# Altium project USB-C_PD_power_supply.PrjPcb
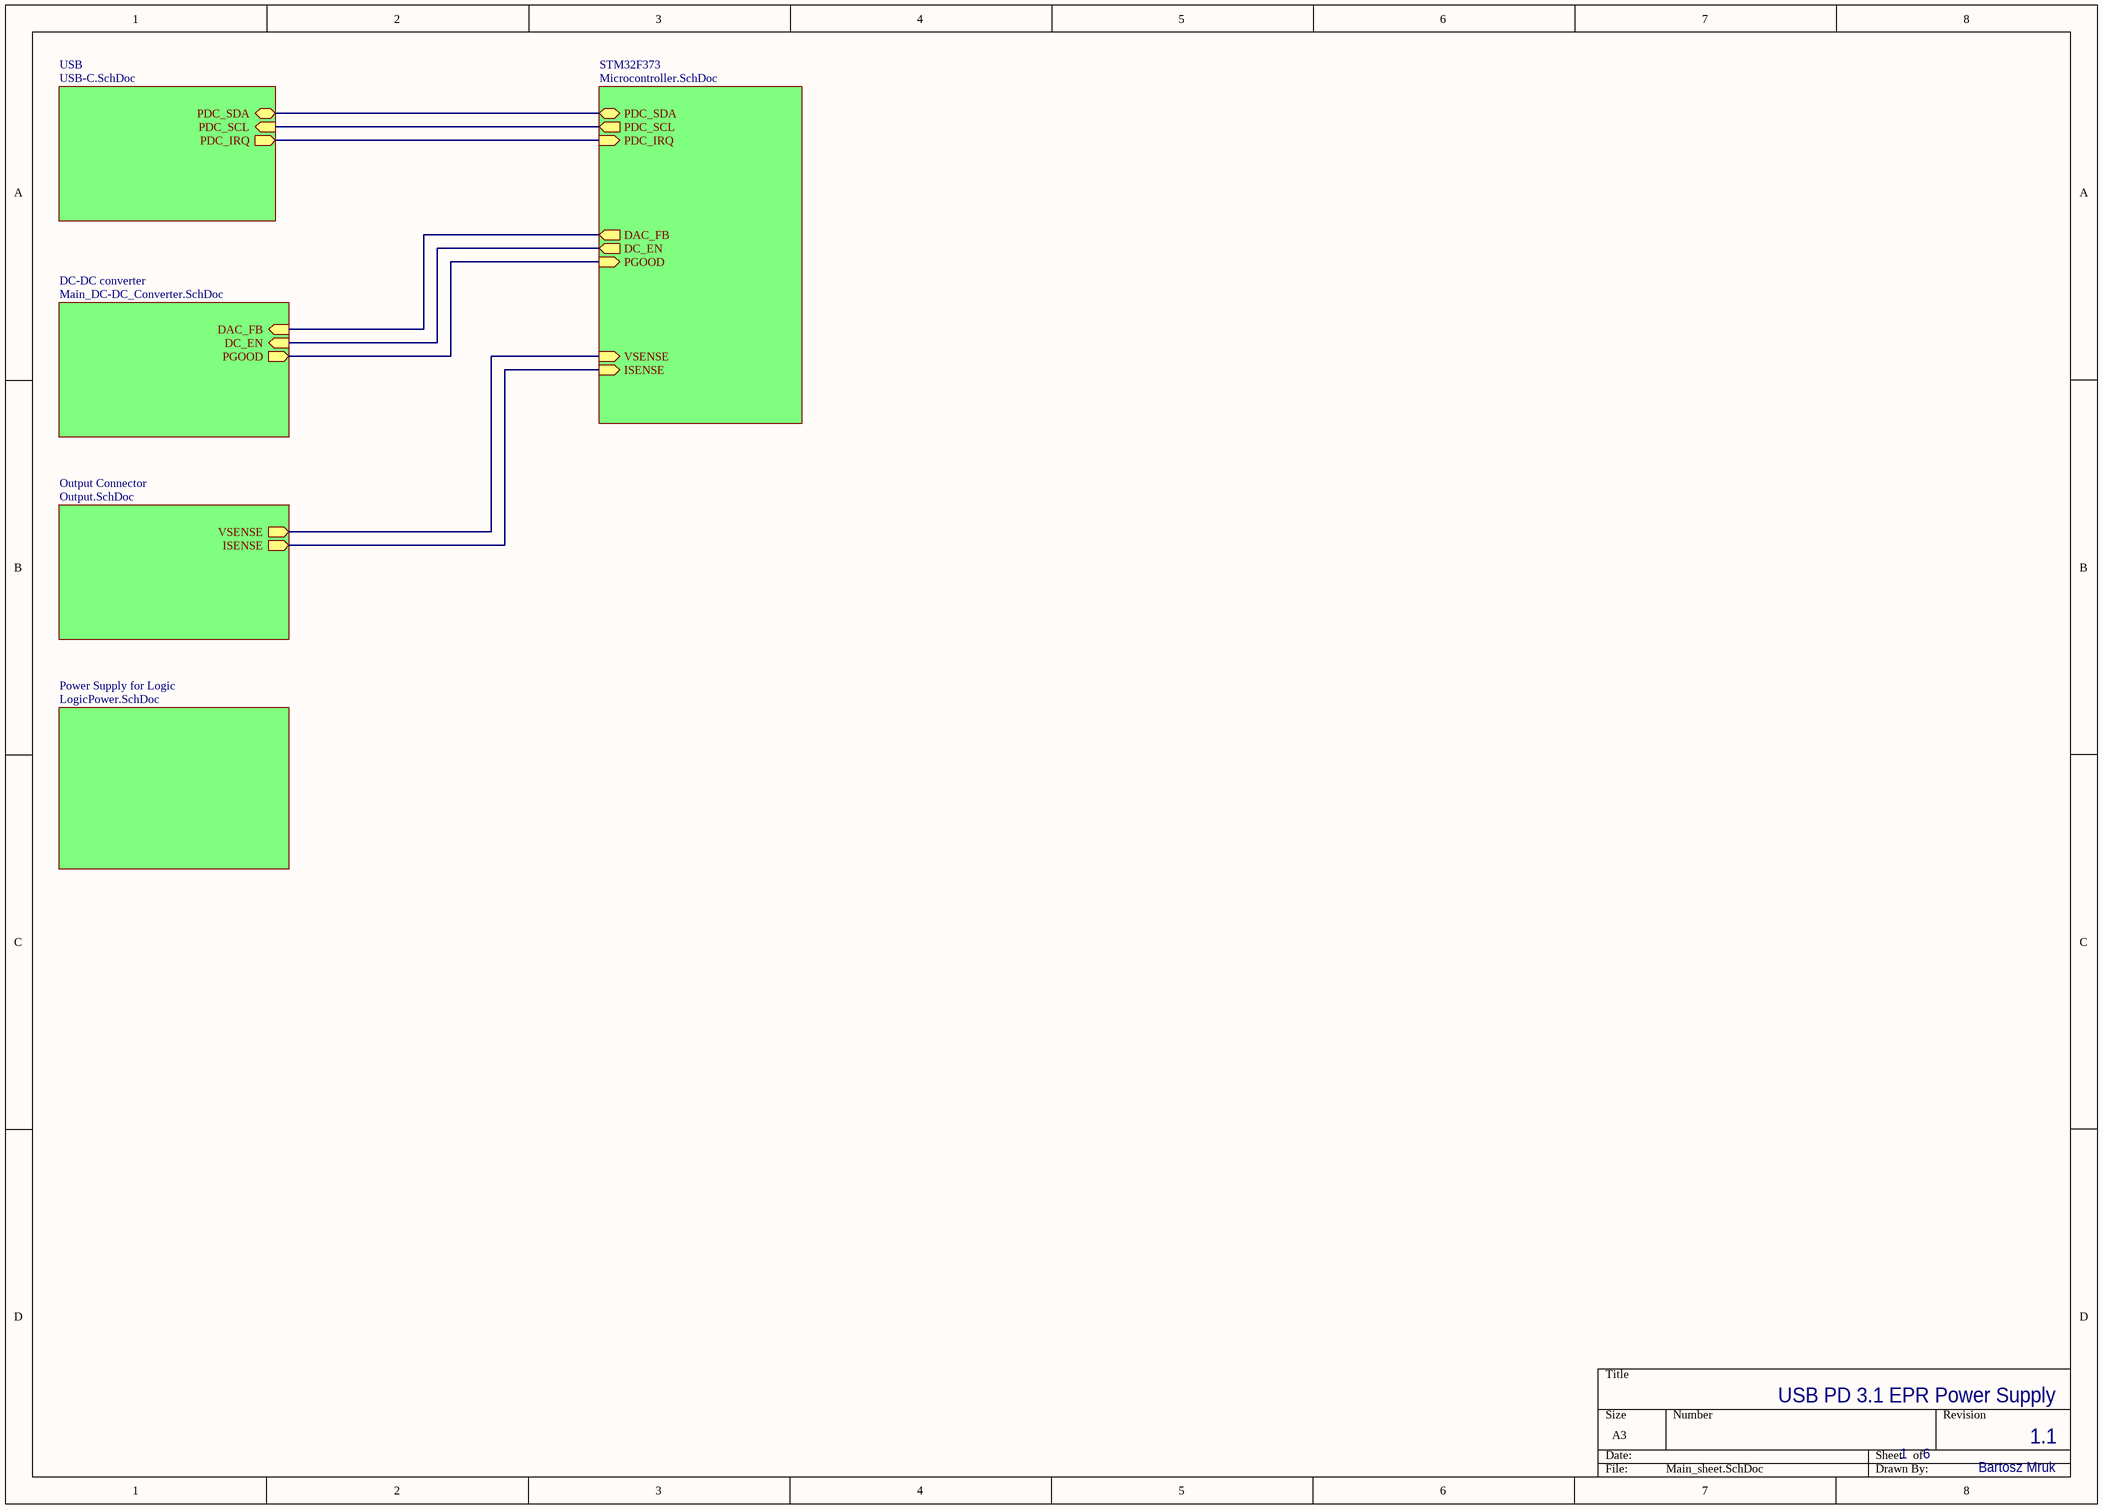
[diagram p0: Main_sheet.SchDoc]
6 sheets, 189 parts. Net scope: hierarchical (ports join the sheet entries above them; power ports are global).
Board file: Device.PcbDoc
Sheets:
  Main_sheet.SchDoc
    USB = USB-C.SchDoc
    STM32F373 = Microcontroller.SchDoc
    Power Supply for Logic = LogicPower.SchDoc
    DC-DC converter = Main_DC-DC_Converter.SchDoc
    Output Connector = Output.SchDoc

## Sheet Main_sheet.SchDoc
size A3; SheetNumber: 1; SheetTotal: 6

### Sub-sheets
DC-DC converter = Main_DC-DC_Converter.SchDoc: DAC_FB (in), DC_EN (in), PGOOD (out)
Output Connector = Output.SchDoc: VSENSE (out), ISENSE (out)
Power Supply for Logic = LogicPower.SchDoc: no entries
STM32F373 = Microcontroller.SchDoc: PDC_SDA (bidir), PDC_SCL (out), VSENSE (in), ISENSE (in), DAC_FB (out), PDC_IRQ (in), DC_EN (out), PGOOD (in)
USB = USB-C.SchDoc: PDC_SDA (bidir), PDC_SCL (in), PDC_IRQ (out)

### Nets
NetR1_2: sheet STM32F373/DC_EN, sheet DC-DC converter/DC_EN
NetR3_2: sheet STM32F373/PGOOD, sheet DC-DC converter/PGOOD
NetR4_1: sheet STM32F373/VSENSE, sheet Output Connector/VSENSE
NetR6_1: sheet STM32F373/ISENSE, sheet Output Connector/ISENSE
NetR10_2: sheet STM32F373/DAC_FB, sheet DC-DC converter/DAC_FB
NetR24_2: sheet USB/PDC_IRQ, sheet STM32F373/PDC_IRQ
NetR25_2: sheet USB/PDC_SDA, sheet STM32F373/PDC_SDA
NetR27_2: sheet USB/PDC_SCL, sheet STM32F373/PDC_SCL

### Notes on the sheet
- 1
- 6
- 1.1
- USB PD 3.1 EPR Power Supply
- Bartosz Mruk

## Sheet USB-C.SchDoc
size A3; SheetNumber: 3; SheetTotal: 6; SPICEModelCacheSZWREHAK: <root> / <DocumentId>SZWREHAK</DocumentId> / <CacheFrame Number="0"> / <Model Name="cap" Kind="MDL"> / <Text>*Default semiconductor capacitor / .MODEL CAP C()</Text> / </Model> / <Model Name="led2" Kind="MDL"> / <Text>*Typ RED,GREEN,YELLOW,AMBER GaAs LED: Vf=2.1V Vr=4V If=40mA trr=3uS / *LED Pinout: 1=A, 2=K / .MODEL LED2 D (IS=93.1P RS=42M N=4.61 BV=4 IBV=10U / + CJO=2.97P VJ=.75 M=.333 TT=4.32U)</Text> / </Model> / </CacheFrame> / </root>
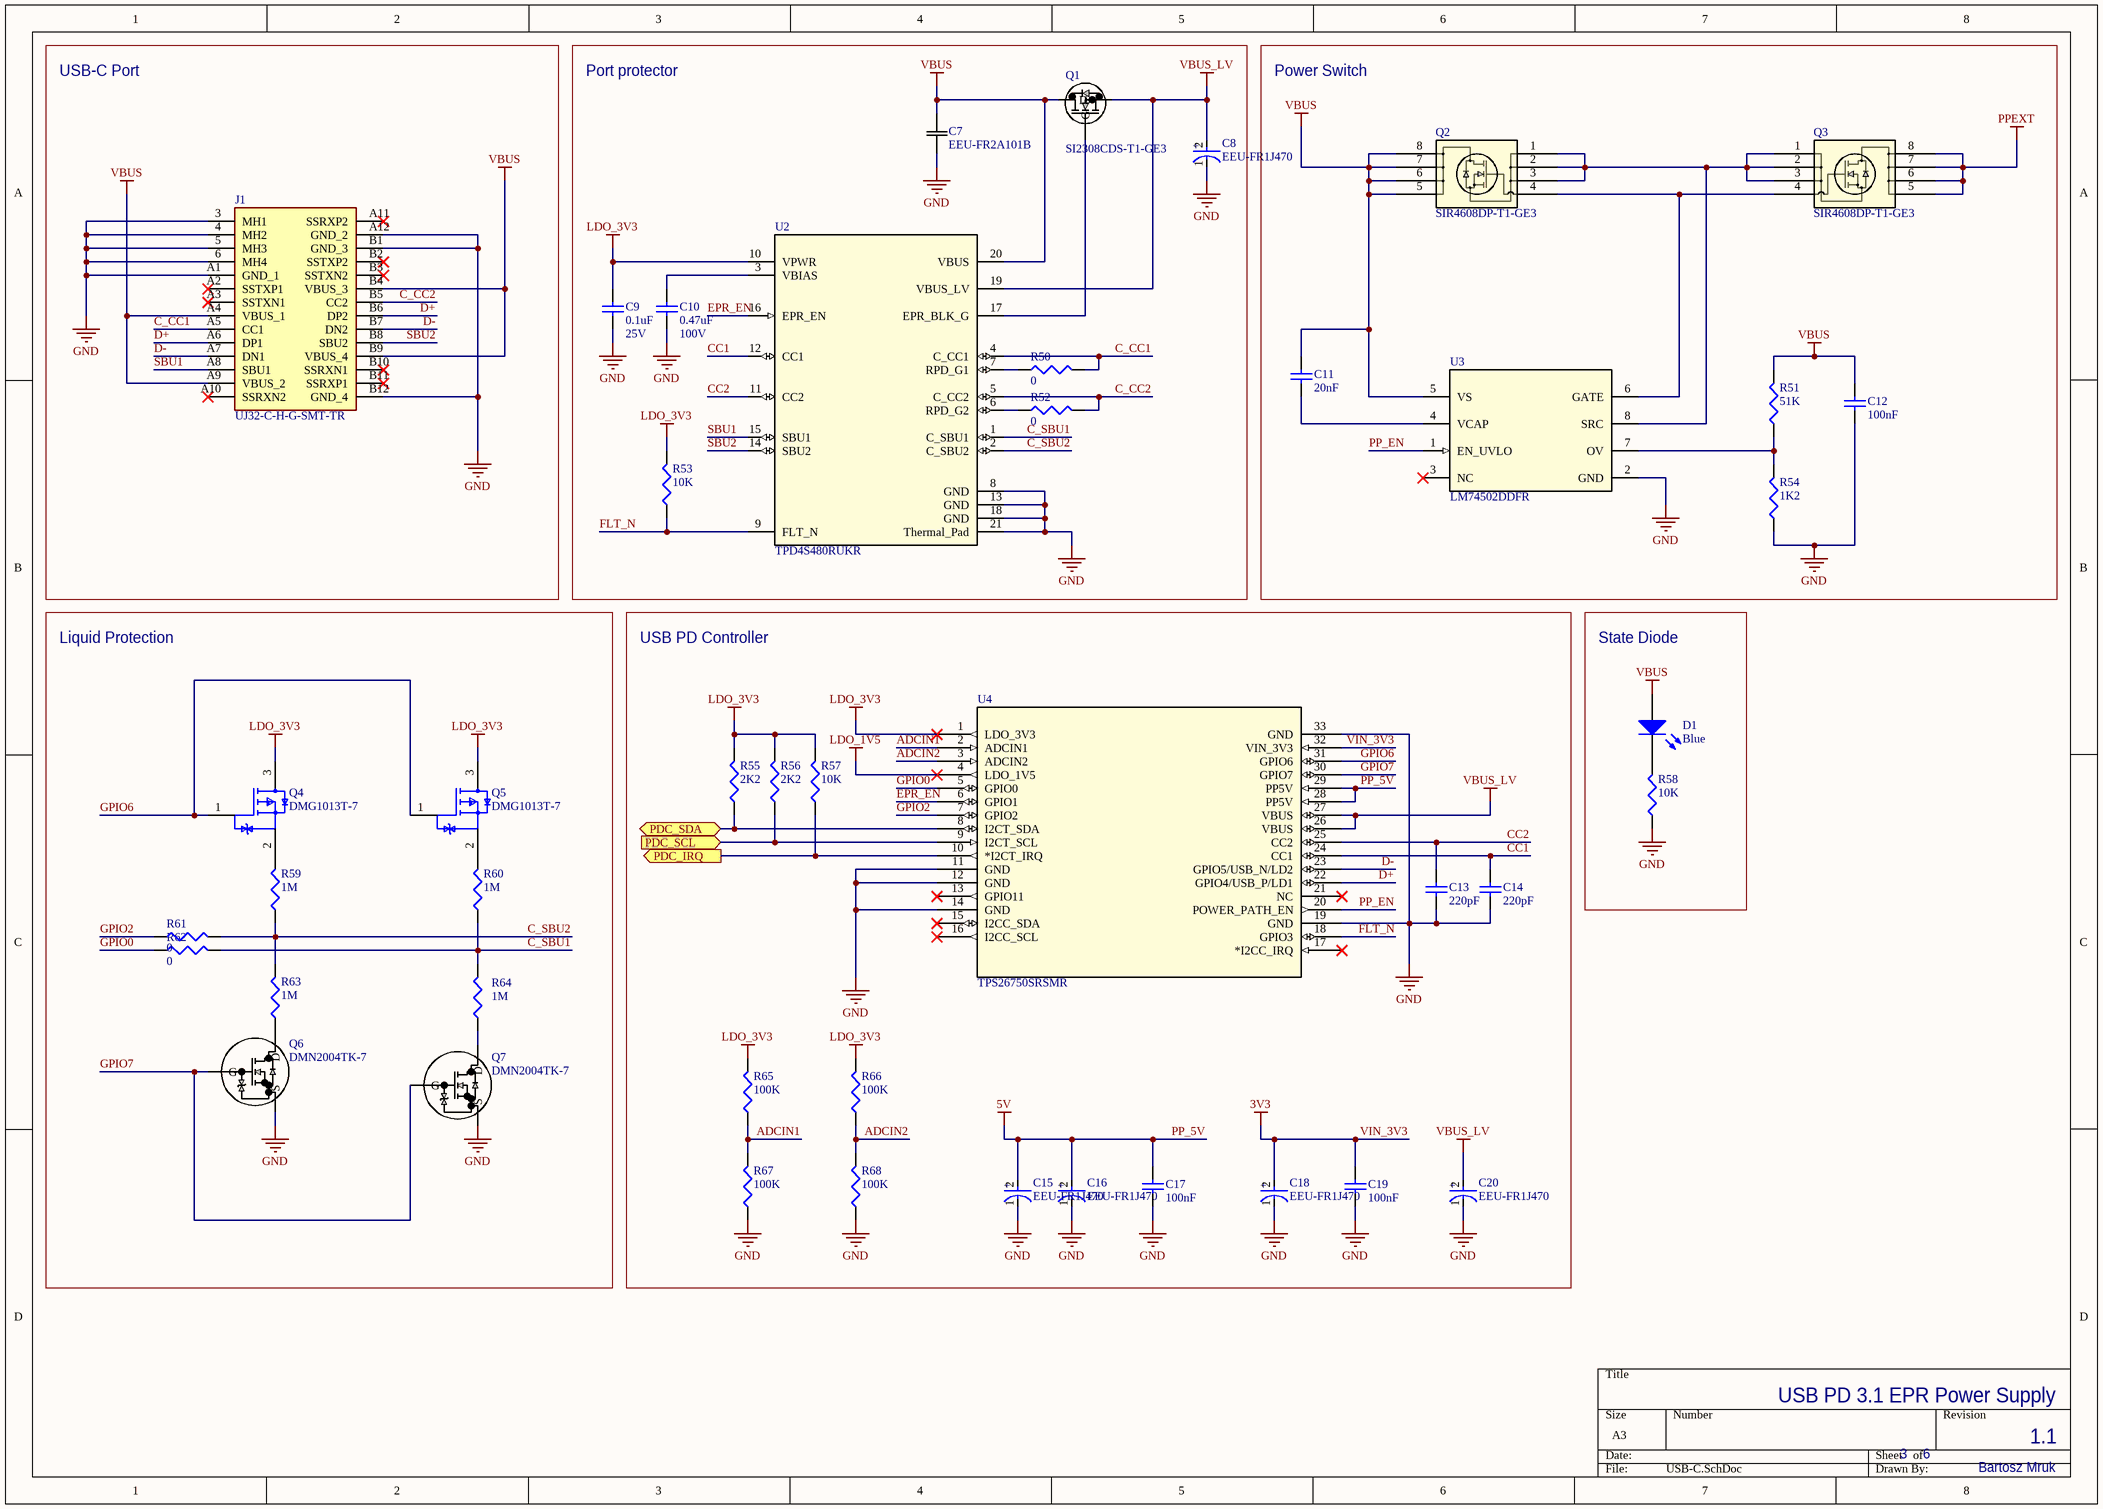
[diagram p1: USB-C.SchDoc]

### Parts
C7  EEU-FR2A101B  [CAP_EEU-FR2A101B_PAN]
C8  EEU-FR1J470  [FP-EEU-FR1J470-MFG]
C9  25V  value 0.1uF  [C1206]
C10  100V  value 0.47uF  [C1206]
C11  value 20nF  [C1206]  (hidden comment: at least 13V)
C12  value 100nF  [C1206]  (hidden comment: Cap Semi)
C13  value 220pF  [0402]  (hidden comment: Cap Semi)
C14  value 220pF  [0402]  (hidden comment: Cap Semi)
C15  EEU-FR1J470  [FP-EEU-FR1J470-MFG]
C16  EEU-FR1J470  [FP-EEU-FR1J470-MFG]
C17  value 100nF  [C1206]  (hidden comment: Cap Semi)
C18  EEU-FR1J470  [FP-EEU-FR1J470-MFG]
C19  value 100nF  [C1206]  (hidden comment: Cap Semi)
C20  EEU-FR1J470  [FP-EEU-FR1J470-MFG]
D1  Blue  [3.2X1.6X1.1]
J1  UJ32-C-H-G-SMT-TR  [UJ32CHGSMTTR]
Q1  SI2308CDS-T1-GE3  [SOT-23_TO-236_VIS]
Q2  SIR4608DP-T1-GE3  [POWERPAK_SO-8_SINGLE_VIS]
Q3  SIR4608DP-T1-GE3  [POWERPAK_SO-8_SINGLE_VIS]
Q4  DMG1013T-7  [FP-SOT523-IPC_A]
Q5  DMG1013T-7  [FP-SOT523-IPC_A]
Q6  DMN2004TK-7  [SOT523_DMN2004_DIO]
Q7  DMN2004TK-7  [SOT523_DMN2004_DIO]
R50  value 0  [J1-0603]  (hidden comment: Res3)
R51  value 51K  [J1-0603]  (hidden comment: Res3)
R52  value 0  [J1-0603]  (hidden comment: Res3)
R53  value 10K  [J1-0603]  (hidden comment: Res3)
R54  value 1K2  [J1-0603]  (hidden comment: Res3)
R55  value 2K2  [J1-0603]  (hidden comment: Res3)
R56  value 2K2  [J1-0603]  (hidden comment: Res3)
R57  value 10K  [J1-0603]  (hidden comment: Res3)
R58  value 10K  [J1-0603]  (hidden comment: Res3)
R59  value 1M  [J1-0603]  (hidden comment: Res3)
R60  value 1M  [J1-0603]  (hidden comment: Res3)
R61  value 0  [J1-0603]  (hidden comment: Res3)
R62  value 0  [J1-0603]  (hidden comment: Res3)
R63  value 1M  [J1-0603]  (hidden comment: Res3)
R64  value 1M  [J1-0603]  (hidden comment: Res3)
R65  value 100K  [J1-0603]  (hidden comment: Res3)
R66  value 100K  [J1-0603]  (hidden comment: Res3)
R67  value 100K  [J1-0603]  (hidden comment: Res3)
R68  value 100K  [J1-0603]  (hidden comment: Res3)
U2  TPD4S480RUKR  [RUK0020B-IPC_A]
U3  LM74502DDFR  [DDF0008A-IPC_A]
U4  TPS26750SRSMR  [VQFN32_RSM_TEX]

### Blocks framed on the sheet
USB-C Port: J1
Port protector: C7-C10 Q1 R50 R52 R53 U2
Power Switch: C11 C12 Q2 Q3 R51 R54 U3
Liquid Protection: Q4-Q7 R59-R64
USB PD Controller: C13-C20 R55-R57 R65-R68 U4
State Diode: D1 R58

### Ports
PDC_IRQ (out), PDC_SCL (in), PDC_SDA (bidir)

### Nets
3V3: C18.2(A) C19.2 U4.32(VIN_3V3)  [also labelled VIN_3V3]
5V: C15.2(A) C16.2(A) C17.2 U4.28(PP5V) U4.29(PP5V)  [also labelled PP_5V]
GND: C7.2 C8.1(C) C9.1 C10.1 C12.1 C13.1 C14.1 C15.1(C) C16.1(C) C17.1 C18.1(C) C19.1 C20.1(C) J1.3(MH1) J1.4(MH2) J1.5(MH3) J1.6(MH4) J1.A1(GND_1) J1.A12(GND_2) J1.B1(GND_3) J1.B12(GND_4) Q6.3(S) Q7.3(S) R54.1 R58.1 R67.1 R68.1 U2.8(GND) U2.13(GND) U2.18(GND) U2.21(Thermal_Pad) U3.2(GND) U4.11(GND) U4.12(GND) U4.14(GND) U4.19(GND) U4.33(GND)
LDO_1V5: U4.4(LDO_1V5)
LDO_3V3: C9.2 Q4.3(D) Q5.3(D) R53.2 R55.2 R56.2 R57.2 R65.2 R66.2 U2.10(VPWR) U4.1(LDO_3V3)
PPEXT: Q3.5 Q3.6 Q3.7 Q3.8
VBUS: C7.1 C11.2 C12.2 D1.1(A) J1.A4(VBUS_1) J1.A9(VBUS_2) J1.B4(VBUS_3) J1.B9(VBUS_4) Q1.2(D) Q2.5 Q2.6 Q2.7 Q2.8 R51.2 U2.20(VBUS) U3.5(VS)
VBUS_LV: C8.2(A) C20.2(A) Q1.3(S) U2.19(VBUS_LV) U4.26(VBUS) U4.27(VBUS)
ADCIN1: R65.1 R67.2 U4.2(ADCIN1)
ADCIN2: R66.1 R68.2 U4.3(ADCIN2)
C_CC1: J1.A5(CC1) R50.2 U2.4(C_CC1)
C_CC2: J1.B5(CC2) R52.2 U2.5(C_CC2)
C_SBU1: R60.1 R62.2 R64.2 U2.1(C_SBU1)
C_SBU2: R59.1 R61.2 R63.2 U2.2(C_SBU2)
CC1: C14.2 U2.12(CC1) U4.24(CC1)
CC2: C13.2 U2.11(CC2) U4.25(CC2)
D+: J1.A6(DP1) J1.B6(DP2) U4.22(GPIO4/USB_P/LD1)
D-: J1.A7(DN1) J1.B7(DN2) U4.23(GPIO5/USB_N/LD2)
EPR_EN: U2.16(EPR_EN) U4.6(GPIO1)
FLT_N: R53.1 U2.9(FLT_N) U4.18(GPIO3)
GPIO0: R62.1 U4.5(GPIO0)
GPIO2: R61.1 U4.7(GPIO2)
GPIO6: Q4.1(G) Q5.1(G) U4.31(GPIO6)
GPIO7: Q6.1(G) Q7.1(G) U4.30(GPIO7)
PP_EN: U3.1(EN_UVLO) U4.20(POWER_PATH_EN)
SBU1: J1.A8(SBU1) U2.15(SBU1)
SBU2: J1.B8(SBU2) U2.14(SBU2)
NetC10_2: C10.2 U2.3(VBIAS)
NetC11_1: C11.1 U3.4(VCAP)
NetD1_2: D1.2(K) R58.2
NetQ1_1: Q1.1(G) U2.17(EPR_BLK_G)
NetQ2_1: Q2.1 Q2.2 Q2.3 Q3.1 Q3.2 Q3.3 U3.8(SRC)
NetQ2_4: Q2.4 Q3.4 U3.6(GATE)
NetQ4_2: Q4.2(S) R59.2
NetQ5_2: Q5.2(S) R60.2
NetQ6_2: Q6.2(D) R63.1
NetQ7_2: Q7.2(D) R64.1
NetR24_2: R57.1 U4.10(*I2CT_IRQ) ; port PDC_IRQ
NetR25_2: R55.1 U4.8(I2CT_SDA) ; port PDC_SDA
NetR27_2: R56.1 U4.9(I2CT_SCL) ; port PDC_SCL
NetR50_1: R50.1 U2.7(RPD_G1)
NetR51_1: R51.1 R54.2 U3.7(OV)
NetR52_1: R52.1 U2.6(RPD_G2)

Not connected (* = marked no-connect by the designer): J1 A2(SSTXP1)* A3(SSTXN1)* A10(SSRXN2)* A11(SSRXP2)* B2(SSTXP2)* B3(SSTXN2)* B10(SSRXN1)* B11(SSRXP1)*; U3 3(NC)*; U4 13(GPIO11)* 15(I2CC_SDA)* 16(I2CC_SCL)* 17(*I2CC_IRQ)* 21(NC)*

### Notes on the sheet
- 3
- 6
- 1.1
- USB PD 3.1 EPR Power Supply
- Bartosz Mruk
- (in symbol CMP-05427-000066-1) +

### Library data of the parts
C7 = EEU-FR2A101B: No Description Available; Manufacturer_Name: Panasonic; Copyright: Copyright (C) 2025 Ultra Librarian. All rights reserved.; Manufacturer_Part_Number: EEU-FR2A101B
C8 C15 C16 C18 C20 = CMP-05427-000066-1: CAP ALUM 47UF 20% 63V RADIAL; ESR (Equivalent Series Resistance): 210mR; Lead Diameter: 0.5mm; Life (Hours): 5000Hour; Ripple Current (AC): 284mA; Height - Seated (Max): 0.5inch; Radiation Hardening: No; Termination: Radial; Contact Plating: Tin; Length: 11.2mm; Tolerance: 20%; Voltage: 63V; Max Operating Temperature: 105°C; Construction: Cylindrical; Lead Free: Lead Free; Series: FR; Mount: Through Hole; Lead Pitch: 2.5mm; Capacitance: 47uF; Case/Package: Radial; Voltage Rating (DC): 63V; Diameter: 6.3mm; Impedance: 210mR; RoHS Compliant: Yes; Height: 11.2mm; REACH SVHC: No SVHC; Package Quantity: 200; Ripple Current: 284mA; Voltage Rating: 63V; Packaging: Bulk; Min Operating Temperature: -40°C
C9-C14 C17 C19 = Cap Semi: Capacitor (Semiconductor SIM Model); Published: 8-Jun-2000; LatestRevisionDate: 29-May-2009; LatestRevisionNote: IPC-7351 Footprint Added.; PackageReference: C1206; Publisher: Altium Limited; PackageDescription: Chip Capacitor
D1 = LED2: Typical RED, GREEN, YELLOW, AMBER GaAs LED; Published: 8-Jun-2000; LatestRevisionDate: 17-Jul-2002; LatestRevisionNote: Re-released for DXP Platform.; PackageVersion: Feb-2002; PackageReference: 3.2X1.6X1.1; Publisher: Altium Limited; PackageDescription: SM LED; 2 Flat Leads
J1 = UJ32-C-H-G-SMT-TR: UJ32-C-H-G-SMT-TR - Type C, USB 3.2 Gen 2x2, 20 Gbps, 20 Vac, 5 A, Right Angle, Gold Flash, Surface Mount, Black Insulator, USB Receptacle; Manufacturer_Name: Same Sky; Geometry.Height: 3.71mm; Mouser Part Number: 179-UJ32CHGSMTTR; Mouser Price/Stock: https://www.mouser.co.uk/ProductDetail/CUI-Devices/UJ32-C-H-G-SMT-TR?qs=vvQtp7zwQdNJg60%252BwYKIHw%3D%3D; Manufacturer_Part_Number: UJ32-C-H-G-SMT-TR; Datasheet Link: https://www.sameskydevices.com/product/resource/UJ32-C-H-G-SMT-TR.pdf
Q1 = SI2308CDS-T1-GE3: N-CHANNEL 60-V (D-S) MOSFET; Manufacturer_Name: Vishay; Copyright: Copyright (C) 2025 Ultra Librarian. All rights reserved.; Manufacturer_Part_Number: SI2308CDS-T1-GE3
Q2 Q3 = SIR4608DP-T1-GE3: N-CHANNEL 60-V (D-S) MOSFET; Manufacturer_Name: Vishay; Copyright: Copyright (C) 2025 Ultra Librarian. All rights reserved.; Manufacturer_Part_Number: SIR4608DP-T1-GE3; RefDes: RefDes; Type: Type
Q4 Q5 = CMP-12801-000011-2: MOSFET P-CH 20V 0.46A SOT-523; Threshold Voltage: -1V; Continuous Drain Current (ID): 460mA; Rise Time: 8.1ns; Turn-Off Delay Time: 28.4ns; Number of Channels: 1; On-State Resistance: 700mR; Power Dissipation: 270mW; Input Capacitance: 59.76pF; Fall Time: 20.7ns; Turn-On Delay Time: 5.1ns; Drain to Source Resistance: 1R; Drain to Source Breakdown Voltage: -20V; Gate to Source Voltage (Vgs): 6V; Element Configuration: Single; Min Operating Temperature: -55°C; Max Operating Temperature: 150°C; Case/Package: SOT-523; Lead Free: Lead Free; Length: 1.7mm; REACH SVHC: No SVHC; Radiation Hardening: No; Number of Pins: 3; Weight: 7.1E-05oz; Rds On Max: 700mR; Height: 0.8mm; Number of Elements: 1; Packaging: Tape and Reel; Mount: Surface Mount; Width: 0.85mm; Drain to Source Voltage (Vdss): 20V; Max Power Dissipation: 270mW; Contact Plating: Tin; Package Quantity: 1
Q6 Q7 = DMN2004TK-7: Description; Manufacturer_Name: Diodes Inc; Copyright: Copyright (C) 2025 Ultra Librarian. All rights reserved.; Manufacturer_Part_Number: DMN2004TK-7
R50-R68 = Res3: Resistor; Published: 8-Jun-2000; LatestRevisionDate: 29-May-2009; LatestRevisionNote: IPC-7351 Footprint Added.; PackageReference: J1-0603; Publisher: Altium Limited; PackageDescription: Chip Resistor
U2 = TPD4S480RUKR: USB Type-Câ„¢ 48V EPR port protector with short-to-VBUS overvoltage and IEC ESD protection 20-WQFN -40 to 125; Manufacturer_Name: Texas Instruments; TYPE: TYPE; RefDes: RefDes; Copyright: Copyright (C) 2025 Ultra Librarian. All rights reserved.; Manufacturer_Part_Number: TPD4S480RUKR
U3 = LM74502DDFR: 3.2-V to 65-V industrial RPP controller with load disconnect and OVP 8-SOT-23-THIN -40 to 125; Manufacturer_Name: Texas Instruments; TYPE: TYPE; RefDes: RefDes; Copyright: Copyright (C) 2025 Ultra Librarian. All rights reserved.; Manufacturer_Part_Number: LM74502DDFR
U4 = TPS26750SRSMR: USB Type-CÂ® and USB Power Delivery (PD) 3.1 controller with 240-W extended power range support  32-VQFN -40 to 125; Manufacturer_Name: Texas Instruments; Copyright: Copyright (C) 2025 Ultra Librarian. All rights reserved.; Manufacturer_Part_Number: TPS26750SRSMR; RefDes: RefDes; Type: Type

## Sheet Microcontroller.SchDoc
size A3; SheetNumber: 2; SheetTotal: 6; SPICEModelCacheJBUTDGHS: <root> / <DocumentId>JBUTDGHS</DocumentId> / <CacheFrame Number="0"> / <Model Name="cap" Kind="MDL"> / <Text>*Default semiconductor capacitor / .MODEL CAP C()</Text> / </Model> / </CacheFrame> / </root>
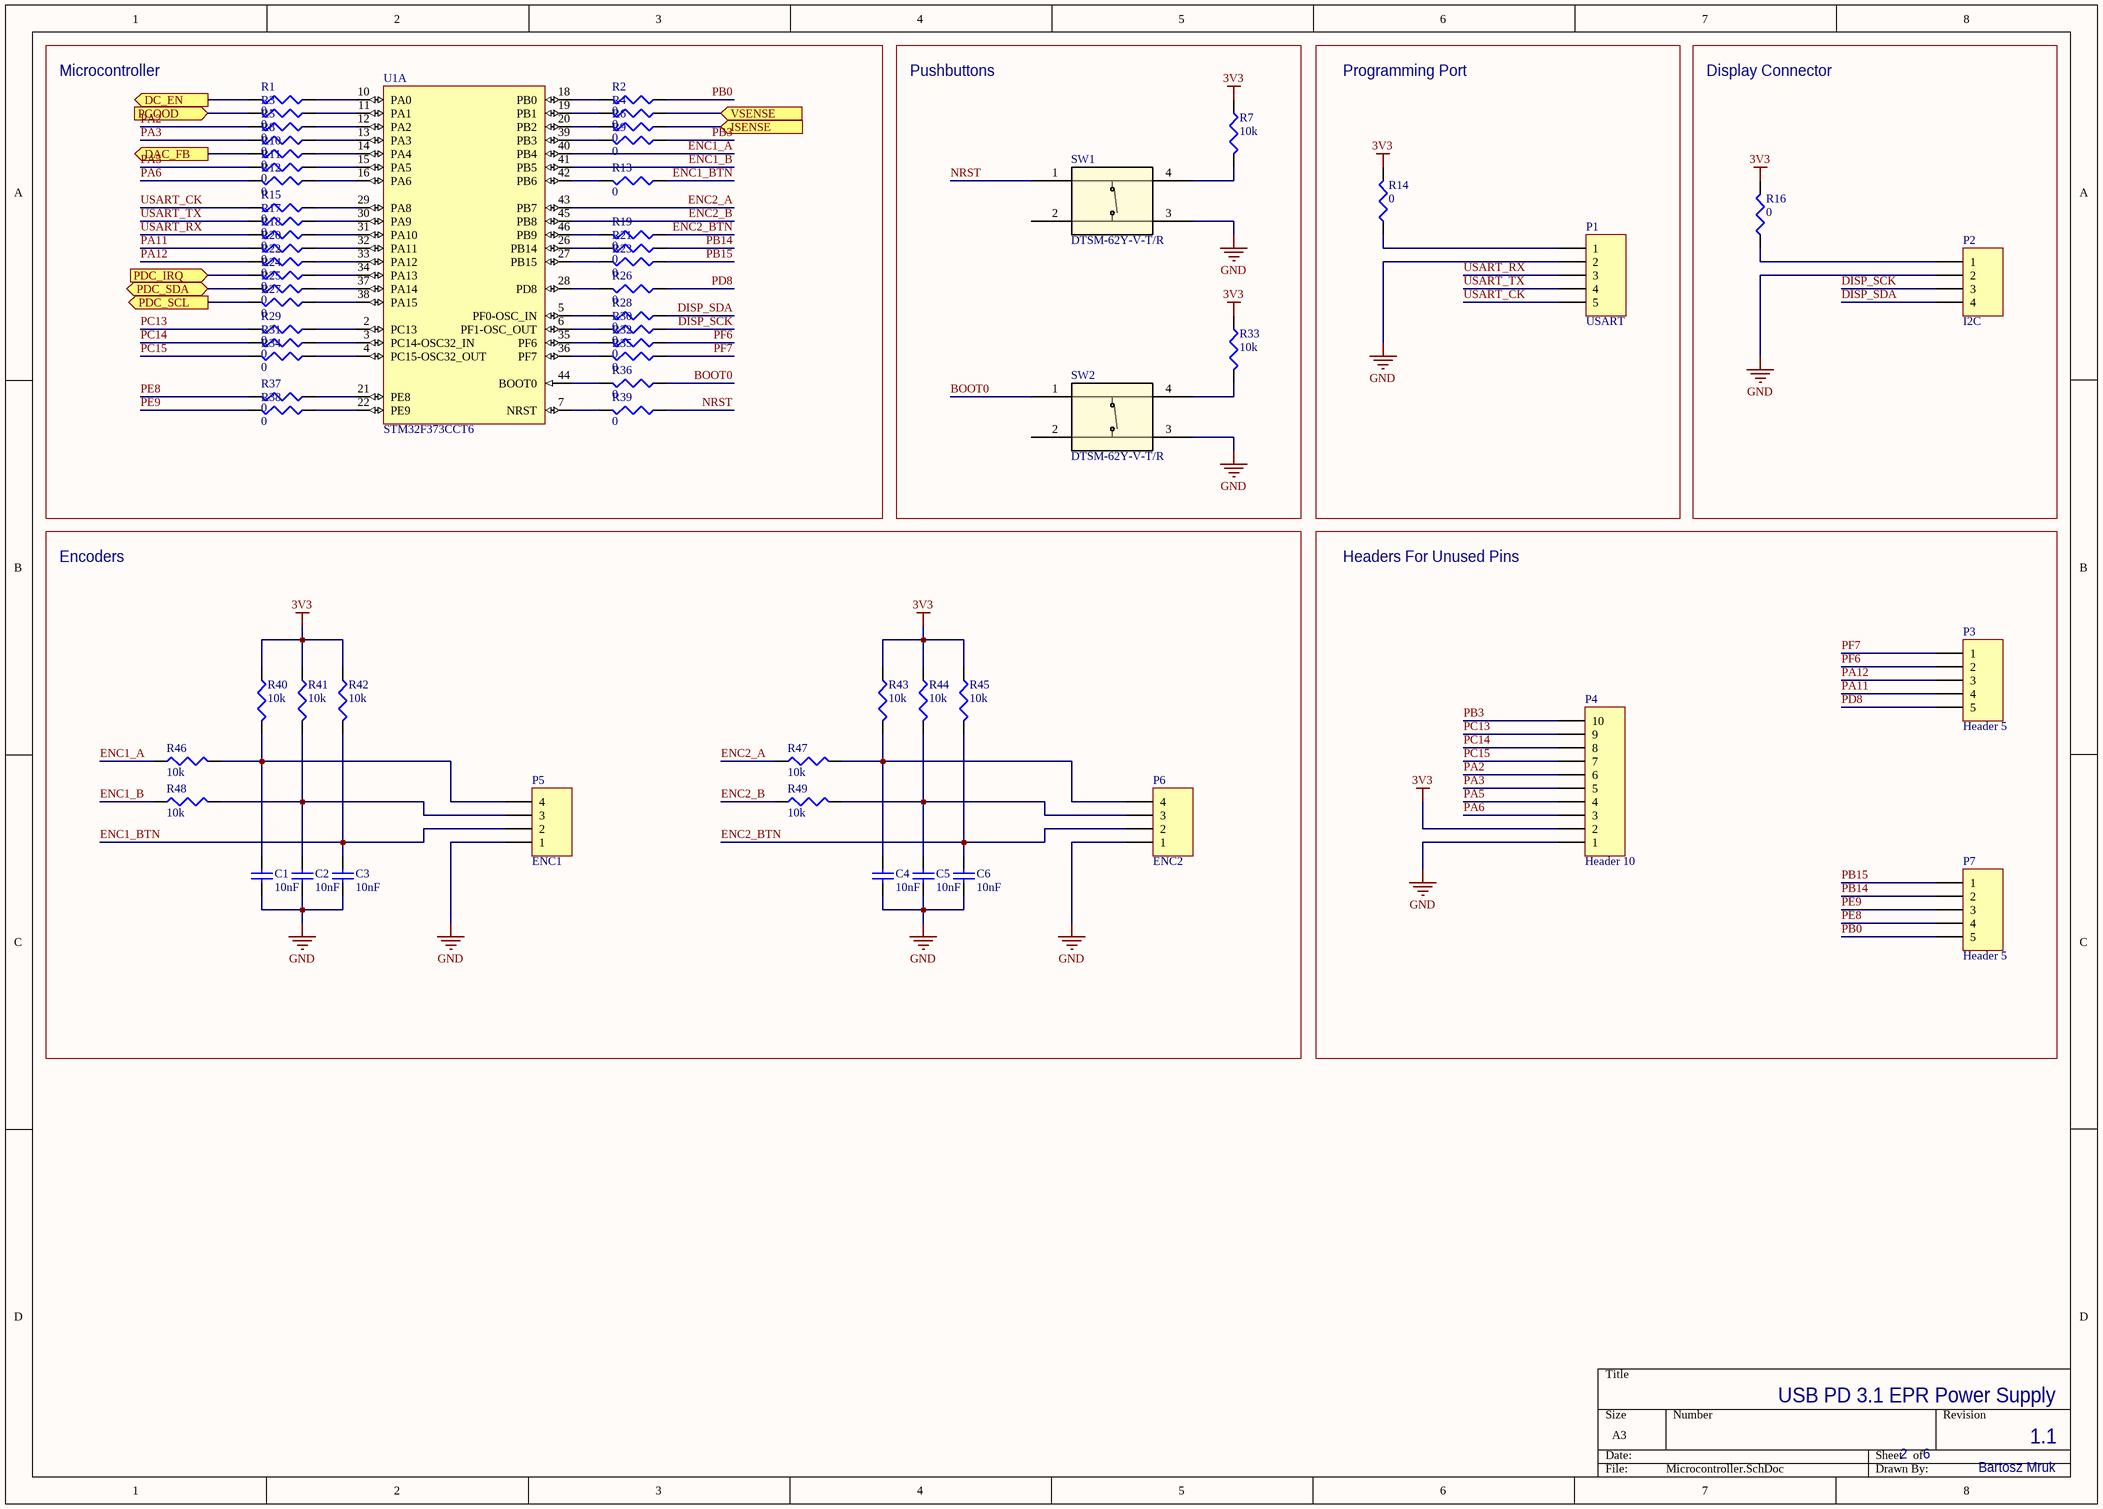
[diagram p2: Microcontroller.SchDoc]

### Parts
C1  value 10nF  [1608[0603]]  (hidden comment: Cap Semi)
C2  value 10nF  [1608[0603]]  (hidden comment: Cap Semi)
C3  value 10nF  [1608[0603]]  (hidden comment: Cap Semi)
C4  value 10nF  [1608[0603]]  (hidden comment: Cap Semi)
C5  value 10nF  [1608[0603]]  (hidden comment: Cap Semi)
C6  value 10nF  [1608[0603]]  (hidden comment: Cap Semi)
P1  USART  [HDR1X5]
P2  I2C  [HDR1X4]
P3  Header 5  [HDR1X5]
P4  Header 10  [HDR1X10]
P5  ENC1  [HDR1X4]
P6  ENC2  [HDR1X4]
P7  Header 5  [HDR1X5]
R1  value 0  [J1-0603]
R2  value 0  [J1-0603]
R3  value 0  [J1-0603]
R4  value 0  [J1-0603]
R5  value 0  [J1-0603]
R6  value 0  [J1-0603]
R7  value 10k  [J1-0603]
R8  value 0  [J1-0603]
R9  value 0  [J1-0603]
R10  value 0  [J1-0603]
R11  value 0  [J1-0603]
R12  value 0  [J1-0603]
R13  value 0  [J1-0603]
R14  value 0  [J1-0603]  (hidden comment: Res3)
R15  value 0  [J1-0603]
R16  value 0  [J1-0603]  (hidden comment: Res3)
R17  value 0  [J1-0603]
R18  value 0  [J1-0603]
R19  value 0  [J1-0603]
R20  value 0  [J1-0603]
R21  value 0  [J1-0603]
R22  value 0  [J1-0603]
R23  value 0  [J1-0603]
R24  value 0  [J1-0603]
R25  value 0  [J1-0603]
R26  value 0  [J1-0603]
R27  value 0  [J1-0603]
R28  value 0  [J1-0603]
R29  value 0  [J1-0603]
R30  value 0  [J1-0603]
R31  value 0  [J1-0603]
R32  value 0  [J1-0603]
R33  value 10k  [J1-0603]
R34  value 0  [J1-0603]
R35  value 0  [J1-0603]
R36  value 0  [J1-0603]
R37  value 0  [J1-0603]
R38  value 0  [J1-0603]
R39  value 0  [J1-0603]
R40  value 10k  [J1-0603]
R41  value 10k  [J1-0603]
R42  value 10k  [J1-0603]
R43  value 10k  [J1-0603]
R44  value 10k  [J1-0603]
R45  value 10k  [J1-0603]
R46  value 10k  [J1-0603]
R47  value 10k  [J1-0603]
R48  value 10k  [J1-0603]
R49  value 10k  [J1-0603]
SW1  DTSM-62Y-V-T/R  [DTSM-62_DIP]
SW2  DTSM-62Y-V-T/R  [DTSM-62_DIP]
U1  STM32F373CCT6  [STM-LQFP48_M]  (part A of 2)

### Blocks framed on the sheet
Microcontroller: R1-R6 R8-R13 R15 R17-R32 R34-R39 U1
Pushbuttons: R7 R33 SW1 SW2
Programming Port: P1 R14
Display Connector: P2 R16
Encoders: C1-C6 P5 P6 R40-R49
Headers For Unused Pins: P3 P4 P7

### Ports
DAC_FB (out), DC_EN (out), ISENSE (in), PDC_IRQ (in), PDC_SCL (out), PDC_SDA (bidir), PGOOD (in), VSENSE (in)

### Nets
3V3: P4.2 R7.1 R14.2 R16.2 R33.1 R40.1 R41.1 R42.1 R43.1 R44.1 R45.1
GND: C1.1 C2.1 C3.1 C4.1 C5.1 C6.1 P1.2 P2.2 P4.1 P5.1 P6.1 SW1.3 SW2.3
BOOT0: R36.1 SW2.1
DISP_SCK: P2.3 R30.1
DISP_SDA: P2.4 R28.1
ENC1_A: R46.1 U1.40(PB4)
ENC1_B: R48.1 U1.41(PB5)
ENC1_BTN: C3.2 P5.2 R13.1 R42.2
ENC2_A: R47.1 U1.43(PB7)
ENC2_B: R49.1 U1.45(PB8)
ENC2_BTN: C6.2 P6.2 R19.1 R45.2
NRST: R39.1 SW1.1
PA2: P4.6 R5.2
PA3: P4.5 R8.2
PA5: P4.4 R11.2
PA6: P4.3 R12.2
PA11: P3.4 R20.2
PA12: P3.3 R22.2
PB0: P7.5 R2.1
PB3: P4.10 R9.1
PB14: P7.2 R21.1
PB15: P7.1 R23.1
PC13: P4.9 R29.2
PC14: P4.8 R31.2
PC15: P4.7 R34.2
PD8: P3.5 R26.1
PE8: P7.4 R37.2
PE9: P7.3 R38.2
PF6: P3.2 R32.1
PF7: P3.1 R35.1
USART_CK: P1.5 R15.2
USART_RX: P1.3 R18.2
USART_TX: P1.4 R17.2
NetC1_2: C1.2 P5.4 R40.2 R46.2
NetC2_2: C2.2 P5.3 R41.2 R48.2
NetC4_2: C4.2 P6.4 R43.2 R47.2
NetC5_2: C5.2 P6.3 R44.2 R49.2
NetP1_1: P1.1 R14.1
NetP2_1: P2.1 R16.1
NetR1_1: R1.1 U1.10(PA0)
NetR1_2: R1.2 ; port DC_EN
NetR2_2: R2.2 U1.18(PB0)
NetR3_1: R3.1 U1.11(PA1)
NetR3_2: R3.2 ; port PGOOD
NetR4_1: R4.1 ; port VSENSE
NetR4_2: R4.2 U1.19(PB1)
NetR5_1: R5.1 U1.12(PA2)
NetR6_1: R6.1 ; port ISENSE
NetR6_2: R6.2 U1.20(PB2)
NetR7_2: R7.2 SW1.4
NetR8_1: R8.1 U1.13(PA3)
NetR9_2: R9.2 U1.39(PB3)
NetR10_1: R10.1 U1.14(PA4)
NetR10_2: R10.2 ; port DAC_FB
NetR11_1: R11.1 U1.15(PA5)
NetR12_1: R12.1 U1.16(PA6)
NetR13_2: R13.2 U1.42(PB6)
NetR15_1: R15.1 U1.29(PA8)
NetR17_1: R17.1 U1.30(PA9)
NetR18_1: R18.1 U1.31(PA10)
NetR19_2: R19.2 U1.46(PB9)
NetR20_1: R20.1 U1.32(PA11)
NetR21_2: R21.2 U1.26(PB14)
NetR22_1: R22.1 U1.33(PA12)
NetR23_2: R23.2 U1.27(PB15)
NetR24_1: R24.1 U1.34(PA13)
NetR24_2: R24.2 ; port PDC_IRQ
NetR25_1: R25.1 U1.37(PA14)
NetR25_2: R25.2 ; port PDC_SDA
NetR26_2: R26.2 U1.28(PD8)
NetR27_1: R27.1 U1.38(PA15)
NetR27_2: R27.2 ; port PDC_SCL
NetR28_2: R28.2 U1.5(PF0-OSC_IN)
NetR29_1: R29.1 U1.2(PC13)
NetR30_2: R30.2 U1.6(PF1-OSC_OUT)
NetR31_1: R31.1 U1.3(PC14-OSC32_IN)
NetR32_2: R32.2 U1.35(PF6)
NetR33_2: R33.2 SW2.4
NetR34_1: R34.1 U1.4(PC15-OSC32_OUT)
NetR35_2: R35.2 U1.36(PF7)
NetR36_2: R36.2 U1.44(BOOT0)
NetR37_1: R37.1 U1.21(PE8)
NetR38_1: R38.1 U1.22(PE9)
NetR39_2: R39.2 U1.7(NRST)

Not connected (* = marked no-connect by the designer): SW1 2; SW2 2

### Notes on the sheet
- 2
- 6
- 1.1
- USB PD 3.1 EPR Power Supply
- Bartosz Mruk

### Library data of the parts
C1-C6 = Cap Semi: Capacitor (Semiconductor SIM Model); Published: 8-Jun-2000; LatestRevisionDate: 29-May-2009; LatestRevisionNote: IPC-7351 Footprint Added.; PackageReference: C1206; Publisher: Altium Limited; PackageDescription: Chip Capacitor
P1 P3 P7 = Header 5: Header, 5-Pin; LatestRevisionDate: 17-Jul-2002; LatestRevisionNote: Re-released for DXP Platform.; Publisher: Altium Limited
P2 P5 P6 = Header 4: Header, 4-Pin; LatestRevisionDate: 17-Jul-2002; LatestRevisionNote: Re-released for DXP Platform.; Publisher: Altium Limited
P4 = Header 10: Header, 10-Pin; LatestRevisionDate: 17-Jul-2002; LatestRevisionNote: Re-released for DXP Platform.; Publisher: Altium Limited
R1-R49 = Res3: Resistor; Published: 8-Jun-2000; LatestRevisionDate: 29-May-2009; LatestRevisionNote: IPC-7351 Footprint Added.; PackageReference: J1-0603; Publisher: Altium Limited; PackageDescription: Chip Resistor
SW1 SW2 = DTSM-62Y-V-TR: Description; Manufacturer_Name: Diptronics; Copyright: Copyright (C) 2025 Ultra Librarian. All rights reserved.; Manufacturer_Part_Number: DTSM-62Y-V-T/R; RefDes: RefDes; Type: Type
U1 = CMP-0572-00021-2: ARM Cortex-M4 32-bit MCU, 256 KB Flash, 32 KB Internal RAM, 36 I/Os, 48-pin LQFP, -40 to 85 degC, Tray; FLASH Size (Prog) (kB): 256; Internal RAM Size (kB): 32; Operating Frequency(F) (Processor speed) (MHz): 72; I/Os (High Current): 36; Supply Voltage(Vcc) min (V): 2; Mounting Technology: Surface Mount; ComponentLink2Description: Datasheet; PackageReference: LQFP48; Packing: Tray; PackageVersion: Rev. 6, 06/2013; ComponentLink1Description: Manufacturer URL; ComponentLink3Description: Package Specification; ComponentLink2URL: http://www.st.com/st-web-ui/static/active/en/resource/technical/document/datasheet/DM00046749.pdf; PartNumber: STM32F373CCT6; Core: ARM Cortex-M4; ComponentLink1URL: http://www.st.com/web/en/home.html; ComponentLink3URL: http://www.st.com/st-web-ui/static/active/en/resource/technical/document/datasheet/DM00058181.pdf; DatasheetVersion: Rev. 3; PackageDescription: 48-Pin Low Profile Quad Flat Package, 7 x 7 mm Body, 0.5 mm Pitch

## Sheet LogicPower.SchDoc
size A3; SheetNumber: 4; SheetTotal: 6; SPICEModelCacheUIACBXDH: <root> / <DocumentId>UIACBXDH</DocumentId> / <CacheFrame Number="0"> / <Model Name="cap" Kind="MDL"> / <Text>*Default semiconductor capacitor / .MODEL CAP C()</Text> / </Model> / </CacheFrame> / </root>
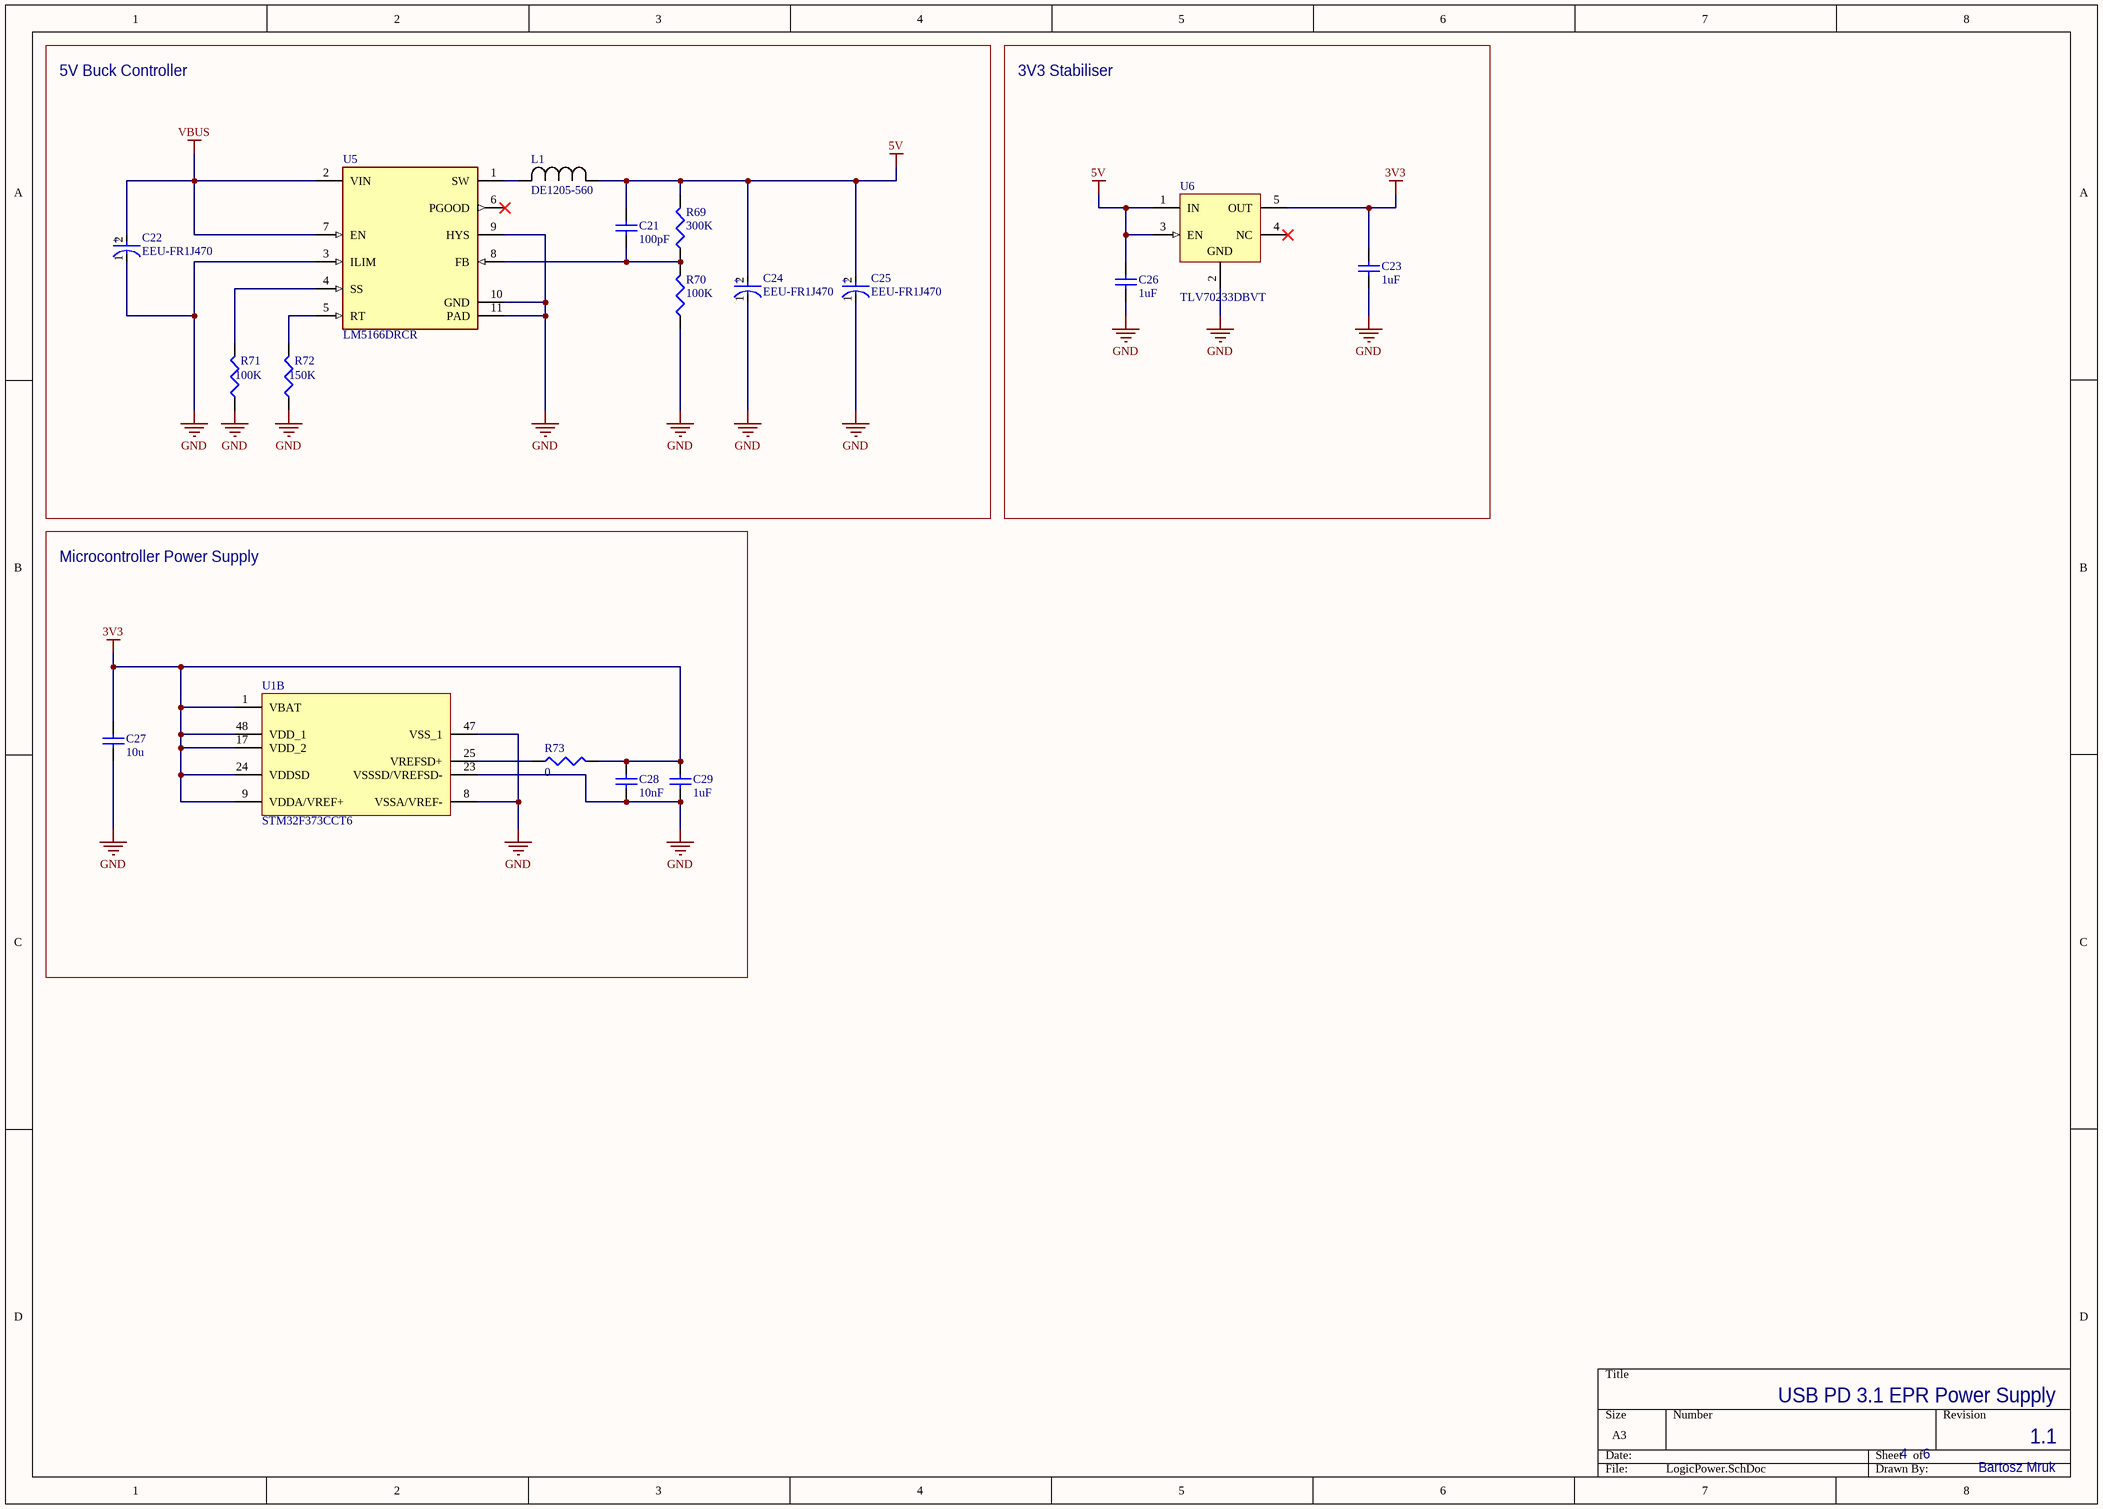
[diagram p3: LogicPower.SchDoc]

### Parts
C21  value 100pF  [C1206]  (hidden comment: Cap Semi)
C22  EEU-FR1J470  [FP-EEU-FR1J470-MFG]
C23  value 1uF  [C1206]  (hidden comment: Cap Semi)
C24  EEU-FR1J470  [FP-EEU-FR1J470-MFG]
C25  EEU-FR1J470  [FP-EEU-FR1J470-MFG]
C26  value 1uF  [C1206]  (hidden comment: Cap Semi)
C27  value 10u  [C1206]  (hidden comment: Cap Semi)
C28  value 10nF  [C1206]  (hidden comment: Cap Semi)
C29  value 1uF  [C1206]  (hidden comment: Cap Semi)
L1  DE1205-560  [IND_DE1205_FRC]
R69  value 300K  [J1-0603]  (hidden comment: Res3)
R70  value 100K  [J1-0603]  (hidden comment: Res3)
R71  value 100K  [J1-0603]  (hidden comment: Res3)
R72  value 150K  [J1-0603]  (hidden comment: Res3)
R73  value 0  [J1-0603]  (hidden comment: Res3)
U1  STM32F373CCT6  [STM-LQFP48_M]  (part B of 2)
U5  LM5166DRCR  [FP-DRC0010J-MFG]
U6  TLV70233DBVT  [DBV0005A_M]

### Blocks framed on the sheet
5V Buck Controller: C21 C22 C24 C25 L1 R69-R72 U5
3V3 Stabiliser: C23 C26 U6
Microcontroller Power Supply: C27-C29 R73 U1

### Nets
3V3: C23.2 C27.2 C28.2 C29.2 R73.2 U1.1(VBAT) U1.9(VDDA/VREF+) U1.17(VDD_2) U1.24(VDDSD) U1.48(VDD_1) U6.5(OUT)
5V: C21.2 C24.2(A) C25.2(A) C26.2 L1.1 R69.2 U6.1(IN) U6.3(EN)
GND: C22.1(C) C23.1 C24.1(C) C25.1(C) C26.1 C27.1 C28.1 C29.1 R70.1 R71.1 R72.1 U1.8(VSSA/VREF-) U1.23(VSSSD/VREFSD-) U1.47(VSS_1) U5.3(ILIM) U5.9(HYS) U5.10(GND) U5.11(PAD) U6.2(GND)
VBUS: C22.2(A) U5.2(VIN) U5.7(EN)
NetC21_1: C21.1 R69.1 R70.2 U5.8(FB)
NetL1_2: L1.2 U5.1(SW)
NetR71_2: R71.2 U5.4(SS)
NetR72_2: R72.2 U5.5(RT)
NetR73_1: R73.1 U1.25(VREFSD+)

Not connected (* = marked no-connect by the designer): U5 6(PGOOD)*; U6 4(NC)*

### Notes on the sheet
- 4
- 6
- 1.1
- USB PD 3.1 EPR Power Supply
- Bartosz Mruk
- (in symbol CMP-05427-000066-1) +

### Library data of the parts
C21 C23 C26-C29 = Cap Semi: Capacitor (Semiconductor SIM Model); Published: 8-Jun-2000; LatestRevisionDate: 29-May-2009; LatestRevisionNote: IPC-7351 Footprint Added.; PackageReference: C1206; Publisher: Altium Limited; PackageDescription: Chip Capacitor
C22 C24 C25 = CMP-05427-000066-1: as C8 on sheet USB-C; Height - Seated (Max): 0.5inch; Radiation Hardening: No; Termination: Radial; Contact Plating: Tin; Length: 11.2mm; Tolerance: 20%; Voltage: 63V; Max Operating Temperature: 105°C; Construction: Cylindrical; Lead Free: Lead Free; Series: FR; Mount: Through Hole; Lead Pitch: 2.5mm; Capacitance: 47uF; Case/Package: Radial; Voltage Rating (DC): 63V; Diameter: 6.3mm; Impedance: 210mR; RoHS Compliant: Yes; Height: 11.2mm; REACH SVHC: No SVHC; Package Quantity: 200; Ripple Current: 284mA; Voltage Rating: 63V; Packaging: Bulk; Min Operating Temperature: -40°C
L1 = DE1205-560: Description; Manufacturer_Name: FerroCore; Copyright: Copyright (C) 2025 Ultra Librarian. All rights reserved.; Manufacturer_Part_Number: DE1205-560
R69-R73 = Res3: Resistor; Published: 8-Jun-2000; LatestRevisionDate: 29-May-2009; LatestRevisionNote: IPC-7351 Footprint Added.; PackageReference: J1-0603; Publisher: Altium Limited; PackageDescription: Chip Resistor
U1 = CMP-0572-00021-2: as U1 on sheet Microcontroller; Mounting Technology: Surface Mount; ComponentLink2Description: Datasheet; PackageReference: LQFP48; Packing: Tray; PackageVersion: Rev. 6, 06/2013; ComponentLink1Description: Manufacturer URL; ComponentLink3Description: Package Specification; ComponentLink2URL: http://www.st.com/st-web-ui/static/active/en/resource/technical/document/datasheet/DM00046749.pdf; PartNumber: STM32F373CCT6; Core: ARM Cortex-M4; ComponentLink1URL: http://www.st.com/web/en/home.html; ComponentLink3URL: http://www.st.com/st-web-ui/static/active/en/resource/technical/document/datasheet/DM00058181.pdf; DatasheetVersion: Rev. 3; PackageDescription: 48-Pin Low Profile Quad Flat Package, 7 x 7 mm Body, 0.5 mm Pitch
U5 = CMP-04918-000087-1: IC REG BUCK ADJ 500MA 10VSON; Manufacturer: Texas Instruments; Output Voltage: 1.23-65V; Switching Frequency: 50-600kHz; Nominal Supply Current: 205-320uA; Max Supply Voltage: 65V; Min Supply Voltage: 3V; Output Type: AdjustableProgrammable; Max Duty Cycle: 100%; Max Junction Temp: +150°C; Standoff Height: 0mm; Number Of Outputs: 1; Temperature Range Low: -40°C; Octopart: https://octopart.com/lm5166drcr-texas+instruments-77040222; Height: 1mm; Temperature: -40°C to +150°C; ComponentLink2Description: Datasheet; Device Class L1: Integrated Circuits (ICs); ComponentLink2URL: http://www.ti.com/lit/ds/symlink/lm5166.pdf; Device Class L3: Voltage Regulators - Switching; Lead Free: Yes; Manufacturer Part Number: LM5166DRCR; RoHS: TRUE; Switching Topology: Buck; Package: DRC0010J; Digikey Description: IC REG BUCK ADJ 500MA 10VSON; Temperature Range High: +150°C; Output Current: 500mA; Category: IC; Automotive: No; Device Class L2: Power Management ICs
U6 = CMP-0394-00524-3: None; Max Output Voltage: 3.3V; Min Input Voltage: 2V; Quiescent Current: 30uA; Accuracy: 2%; Number of Outputs: 1; Power Dissipation: 500mW; Dropout Voltage: 220mV; Output Voltage Accuracy: 0.5%; Max Output Current: 300mA; Polarity: Positive; Power Supply Rejection Ratio (PSRR): 68dB; Output Type: Fixed; Max Input Voltage: 5.5V; Min Current Limit: 320mA; REACH SVHC: No SVHC; RoHS Compliant: Yes; Length: 3.05mm; Radiation Hardening: No; Lead Free: Lead Free; Height: 1.45mm; Output Voltage: 3.3V; Min Operating Temperature: -40°C; Package Quantity: 1; Width: 1.75mm; Number of Regulators: 1; Case/Package: SOT-23; Number of Pins: 5; Output Current: 300mA; Packaging: Tape and Reel; Min Output Voltage: 3.3V; Max Operating Temperature: 125°C; Series: -; Nominal Output Voltage: 3.3V; Max Power Dissipation: 500mW

## Sheet Main_DC-DC_Converter.SchDoc
size A3; SheetNumber: 5; SheetTotal: 6; SPICEModelCacheKWJYRVGK: <root> / <DocumentId>KWJYRVGK</DocumentId> / <CacheFrame Number="0"> / <Model Name="cap" Kind="MDL"> / <Text>*Default semiconductor capacitor / .MODEL CAP C()</Text> / </Model> / <Model Name="skydiode" Kind="MDL"> / <Text>*Default Schottky Diode / *Schottky Diode Pinout: A,K / .MODEL SKYDIODE D(EG=0.69 XTI=2)</Text> / </Model> / <Model Name="led2" Kind="MDL"> / <Text>*Typ RED,GREEN,YELLOW,AMBER GaAs LED: Vf=2.1V Vr=4V If=40mA trr=3uS / *LED Pinout: 1=A, 2=K / .MODEL LED2 D (IS=93.1P RS=42M N=4.61 BV=4 IBV=10U / + CJO=2.97P VJ=.75 M=.333 TT=4.32U)</Text> / </Model> / </CacheFrame> / </root>
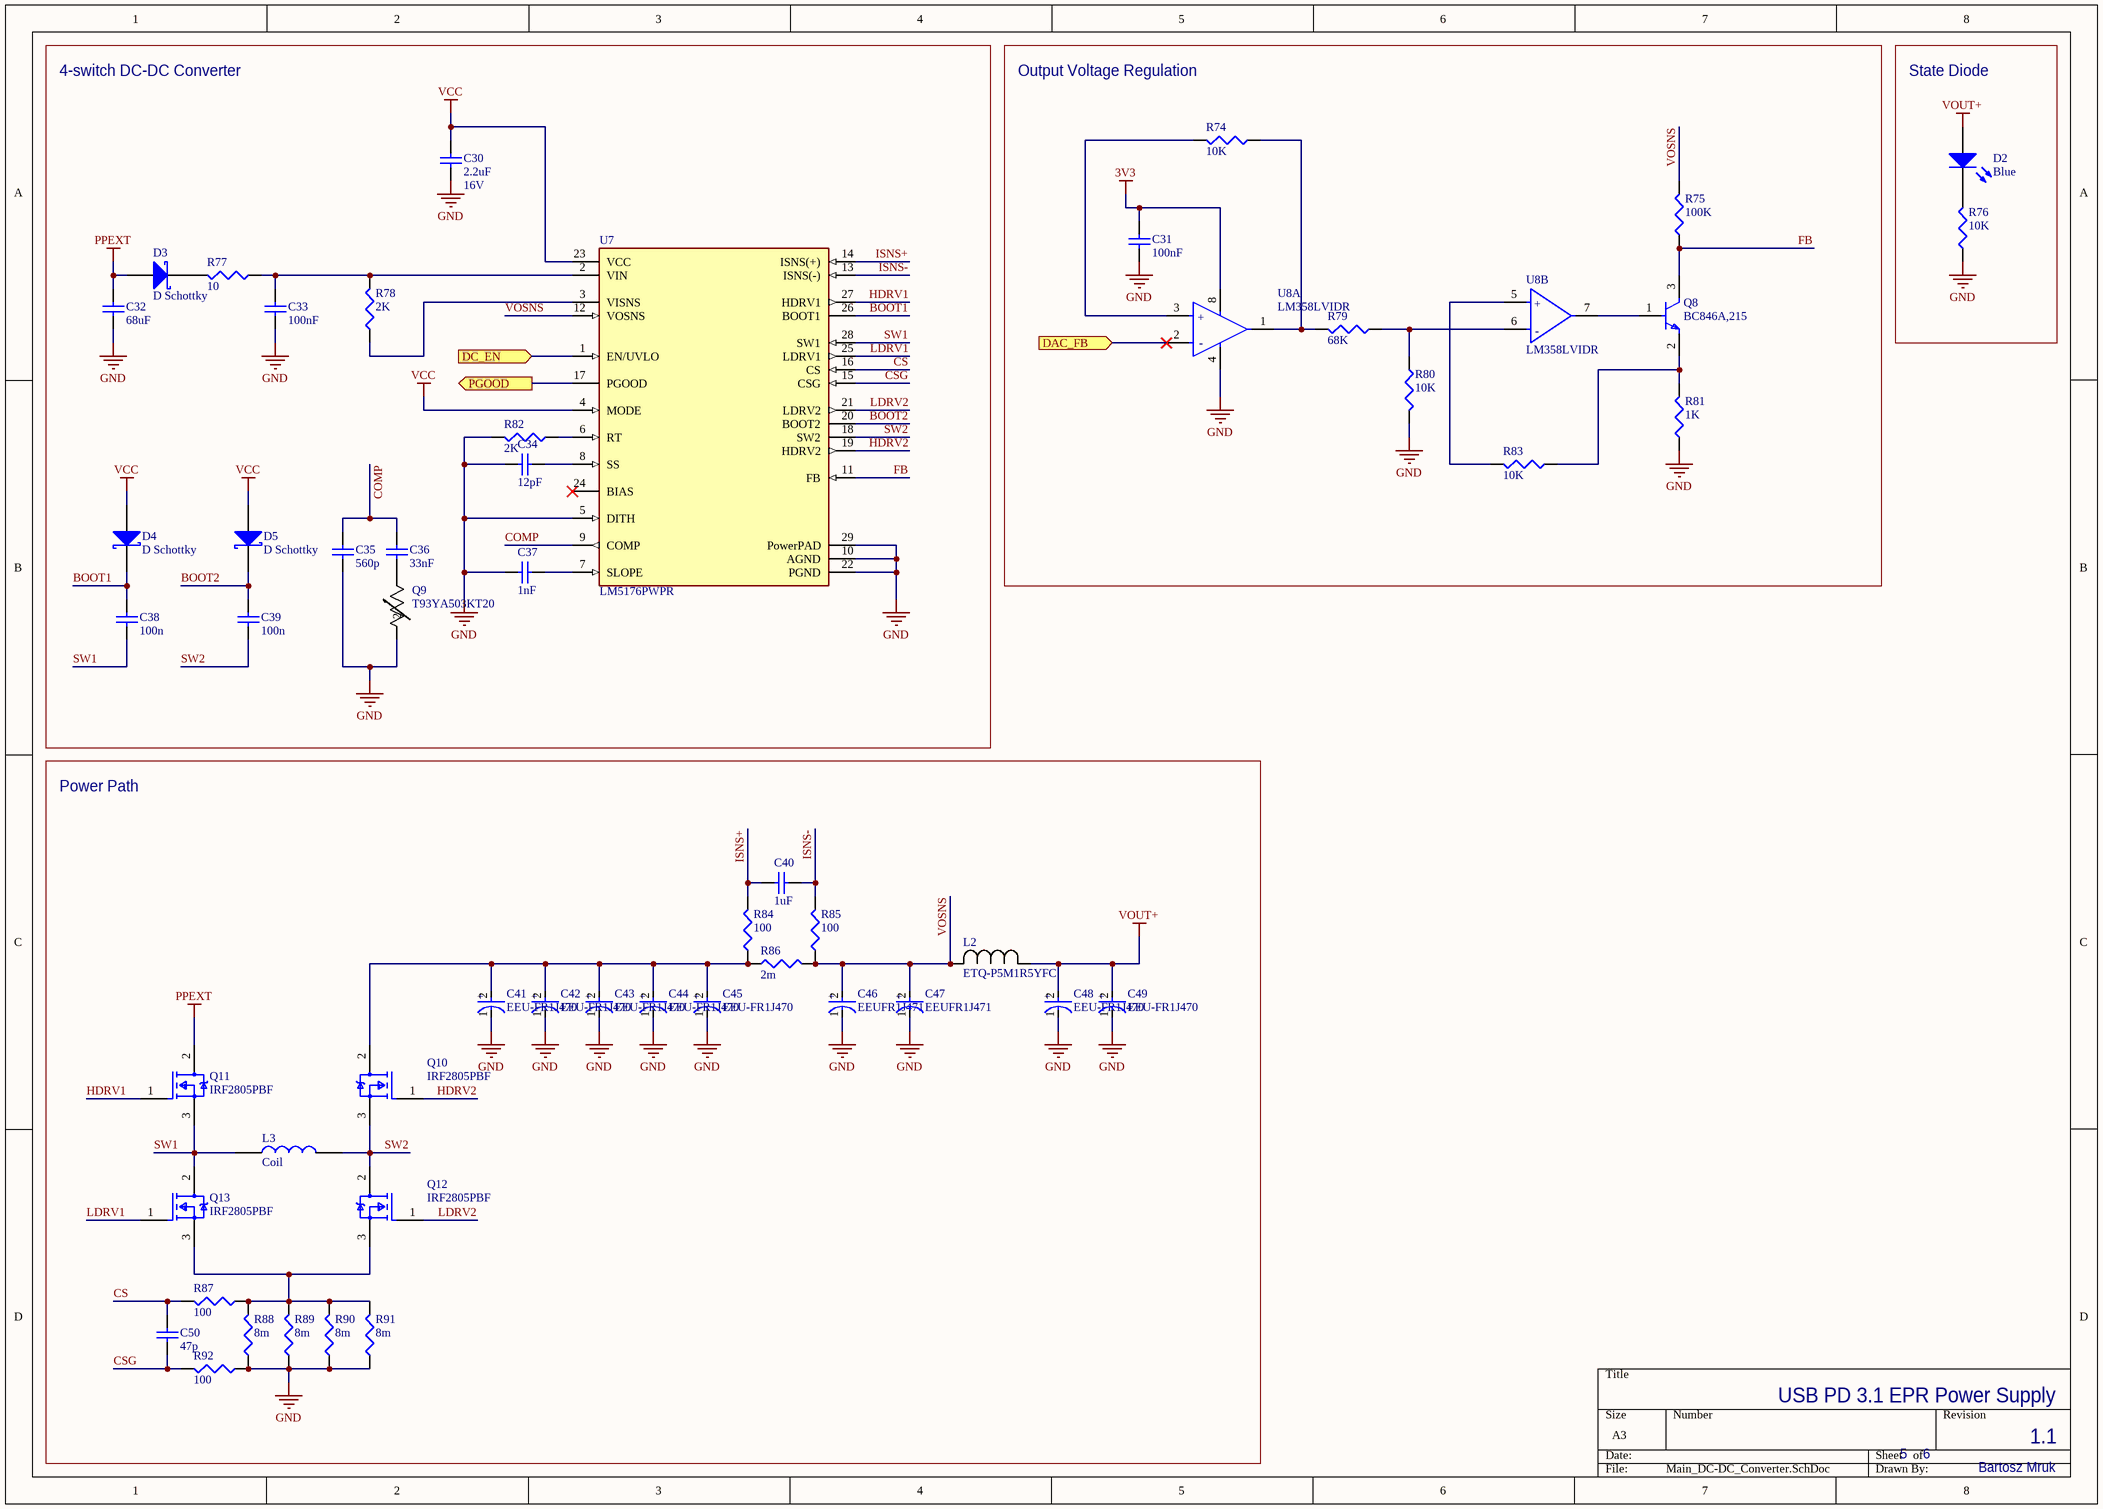
[diagram p4: Main_DC-DC_Converter.SchDoc]

### Parts
C30  16V  value 2.2uF  [C1206]
C31  value 100nF  [C1206]  (hidden comment: Cap Semi)
C32  value 68uF  [C1206]  (hidden comment: Cap Semi)
C33  value 100nF  [C1206]  (hidden comment: Cap Semi)
C34  value 12pF  [C1206]  (hidden comment: Cap Semi)
C35  value 560p  [C1206]  (hidden comment: Cap Semi)
C36  value 33nF  [C1206]  (hidden comment: Cap Semi)
C37  value 1nF  [C1206]  (hidden comment: Cap Semi)
C38  value 100n  [C1206]  (hidden comment: Cap Semi)
C39  value 100n  [C1206]  (hidden comment: Cap Semi)
C40  value 1uF  [C1206]  (hidden comment: Cap Semi)
C41  EEU-FR1J470  [FP-EEU-FR1J470-MFG]
C42  EEU-FR1J470  [FP-EEU-FR1J470-MFG]
C43  EEU-FR1J470  [FP-EEU-FR1J470-MFG]
C44  EEU-FR1J470  [FP-EEU-FR1J470-MFG]
C45  EEU-FR1J470  [FP-EEU-FR1J470-MFG]
C46  EEUFR1J471  [FP-RAD-TH-D_12_5_0_5-L_25-MFG]
C47  EEUFR1J471  [FP-RAD-TH-D_12_5_0_5-L_25-MFG]
C48  EEU-FR1J470  [FP-EEU-FR1J470-MFG]
C49  EEU-FR1J470  [FP-EEU-FR1J470-MFG]
C50  value 47p  [C1206]  (hidden comment: Cap Semi)
D2  Blue  [3.2X1.6X1.1]
D3  D Schottky  [SMB]
D4  D Schottky  [SMB]
D5  D Schottky  [SMB]
L2  ETQ-P5M1R5YFC  [IND_PCC-M1054M_PAN]
L3  Coil  [744711003]
Q8  BC846A,215  [FP-SOT23-IPC_A]
Q9  T93YA503KT20  [TRIM_503KT20_VIS]
Q10  IRF2805PBF  [FP-PG-TO220-3-MFG]
Q11  IRF2805PBF  [FP-PG-TO220-3-MFG]
Q12  IRF2805PBF  [FP-PG-TO220-3-MFG]
Q13  IRF2805PBF  [FP-PG-TO220-3-MFG]
R74  value 10K  [J1-0603]  (hidden comment: Res3)
R75  value 100K  [J1-0603]  (hidden comment: Res3)
R76  value 10K  [J1-0603]  (hidden comment: Res3)
R77  value 10  [J1-0603]  (hidden comment: Res3)
R78  value 2K  [J1-0603]  (hidden comment: Res3)
R79  value 68K  [J1-0603]  (hidden comment: Res3)
R80  value 10K  [J1-0603]  (hidden comment: Res3)
R81  value 1K  [J1-0603]  (hidden comment: Res3)
R82  value 2K  [J1-0603]  (hidden comment: Res3)
R83  value 10K  [J1-0603]  (hidden comment: Res3)
R84  value 100  [J1-0603]  (hidden comment: Res3)
R85  value 100  [J1-0603]  (hidden comment: Res3)
R86  value 2m  [RESC6332]  (hidden comment: Res3)
R87  value 100  [J1-0603]  (hidden comment: Res3)
R88  value 8m  [RESC6332]  (hidden comment: Res3)
R89  value 8m  [RESC6332]  (hidden comment: Res3)
R90  value 8m  [RESC6332]  (hidden comment: Res3)
R91  value 8m  [RESC6332]  (hidden comment: Res3)
R92  value 100  [J1-0603]  (hidden comment: Res3)
U7  LM5176PWPR  [FP-PWP0028C-IPC_C]
U8  LM358LVIDR  [FP-D0008A-IPC_A]  (parts A,B of 2)

### Blocks framed on the sheet
4-switch DC-DC Converter: C30 C32-C39 D3-D5 Q9 R77 R78 R82 U7
Output Voltage Regulation: C31 Q8 R74 R75 R79-R81 R83 U8
State Diode: D2 R76
Power Path: C40-C50 L2 L3 Q10-Q13 R84-R92

### Ports
DAC_FB (in), DC_EN (in), PGOOD (out)

### Nets
3V3: C31.2 U8.8(V+)
GND: C30.1 C31.1 C32.1 C33.1 C34.2 C35.1 C37.2 C41.1(C) C42.1(C) C43.1(C) C44.1(C) C45.1(C) C46.1(C) C47.1(C) C48.1(C) C49.1(C) Q9.2 R76.1 R80.2 R81.1 R82.2 R88.1 R89.1 R90.1 R91.1 R92.1 U7.5(DITH) U7.10(AGND) U7.22(PGND) U7.29(PowerPAD) U8.4(V-)
PPEXT: C32.2 D3.1(A) Q11.2(D)
VCC: C30.2 D4.1(A) D5.1(A) U7.4(MODE) U7.23(VCC)
VOUT+: C48.2(A) C49.2(A) D2.1(A) L2.1
BOOT1: C38.2 D4.2(K) U7.26(BOOT1)
BOOT2: C39.2 D5.2(K) U7.20(BOOT2)
COMP: C35.2 C36.2 U7.9(COMP)
CS: C50.2 R87.2 U7.16(CS)
CSG: C50.1 R92.2 U7.15(CSG)
FB: Q8.3(C) R75.1 U7.11(FB)
HDRV1: Q11.1(G) U7.27(HDRV1)
HDRV2: Q10.1(G) U7.19(HDRV2)
ISNS+: C40.1 R84.2 U7.14(ISNS(+))
ISNS-: C40.2 R85.2 U7.13(ISNS(-))
LDRV1: Q13.1(G) U7.25(LDRV1)
LDRV2: Q12.1(G) U7.21(LDRV2)
SW1: C38.1 L3.1 Q11.3(S) Q13.2(D) U7.28(SW1)
SW2: C39.1 L3.2 Q10.3(S) Q12.2(D) U7.18(SW2)
VOSNS: C46.2(A) C47.2(A) L2.2 R75.2 R85.1 R86.2 U7.12(VOSNS)
NetC33_2: C33.2 R77.1 R78.2 U7.2(VIN)
NetC34_1: C34.1 U7.8(SS)
NetC36_1: C36.1 Q9.1
NetC37_1: C37.1 U7.7(SLOPE)
NetC41_2: C41.2(A) C42.2(A) C43.2(A) C44.2(A) C45.2(A) Q10.2(D) R84.1 R86.1
NetD2_2: D2.2(K) R76.2
NetD3_2: D3.2(K) R77.2
NetQ8_1: Q8.1(B) U8.7(OUT2)
NetQ8_2: Q8.2(E) R81.2 R83.1
NetQ12_3: Q12.3(S) Q13.3(S) R87.1 R88.2 R89.2 R90.2 R91.2
NetR1_2: U7.1(EN/UVLO) ; port DC_EN
NetR3_2: U7.17(PGOOD) ; port PGOOD
NetR10_2: U8.2(IN1-) ; port DAC_FB
NetR74_1: R74.1 R79.2 U8.1(OUT1)
NetR74_2: R74.2 U8.3(IN1+)
NetR78_1: R78.1 U7.3(VISNS)
NetR79_1: R79.1 R80.1 U8.6(IN2-)
NetR82_1: R82.1 U7.6(RT)
NetR83_2: R83.2 U8.5(IN2+)

Not connected (* = marked no-connect by the designer): U7 24(BIAS)*

### Notes on the sheet
- 5
- 6
- 1.1
- USB PD 3.1 EPR Power Supply
- Bartosz Mruk
- (in symbol CMP-04895-000442-1, part A) +; -
- (in symbol CMP-04895-000442-1, part B) +; -
- (in symbol CMP-05427-000066-1) +
- (in symbol CMP-05427-000281-1) +

### Library data of the parts
C30-C40 C50 = Cap Semi: Capacitor (Semiconductor SIM Model); Published: 8-Jun-2000; LatestRevisionDate: 29-May-2009; LatestRevisionNote: IPC-7351 Footprint Added.; PackageReference: C1206; Publisher: Altium Limited; PackageDescription: Chip Capacitor
C41-C45 C48 C49 = CMP-05427-000066-1: as C8 on sheet USB-C; Height - Seated (Max): 0.5inch; Radiation Hardening: No; Termination: Radial; Contact Plating: Tin; Length: 11.2mm; Tolerance: 20%; Voltage: 63V; Max Operating Temperature: 105°C; Construction: Cylindrical; Lead Free: Lead Free; Series: FR; Mount: Through Hole; Lead Pitch: 2.5mm; Capacitance: 47uF; Case/Package: Radial; Voltage Rating (DC): 63V; Diameter: 6.3mm; Impedance: 210mR; RoHS Compliant: Yes; Height: 11.2mm; REACH SVHC: No SVHC; Package Quantity: 200; Ripple Current: 284mA; Voltage Rating: 63V; Packaging: Bulk; Min Operating Temperature: -40°C
C46 C47 = CMP-05427-000281-1: Aluminum Electrolytic Capacitors (Radial Lead Type) 470uF ±20% 63V; Impedance: 27mR; Lead Diameter: 0.6mm; Ripple Current: 1.995A; Life (Hours): 10000Hour; Series: FR; Tolerance: 20%; Max Operating Temperature: 105°C; Diameter: 12.5mm; Height - Seated (Max): 1.063inch; Termination: Radial; Voltage Rating: 63V; Contact Plating: Tin; Height: 25mm; Case/Package: Radial; Packaging: Bulk; Length: 25mm; Mount: Through Hole; Construction: Cylindrical; Package Quantity: 100; Ripple Current (AC): 1.995A; Radiation Hardening: No; Voltage: 63V; Capacitance: 470uF; RoHS Compliant: Yes; Min Operating Temperature: -40°C; ESR (Equivalent Series Resistance): 27mR; Lead Free: Lead Free; Lead Pitch: 5mm; Voltage Rating (DC): 63V
D2 = LED2: as D1 on sheet USB-C; Published: 8-Jun-2000; LatestRevisionDate: 17-Jul-2002; LatestRevisionNote: Re-released for DXP Platform.; PackageVersion: Feb-2002; PackageReference: 3.2X1.6X1.1; Publisher: Altium Limited; PackageDescription: SM LED; 2 Flat Leads
D3-D5 = D Schottky: Schottky Diode; Published: 8-Jun-2000; LatestRevisionDate: 17-Jul-2002; LatestRevisionNote: Re-released for DXP Platform.; PackageReference: SMB; Publisher: Altium Limited; PackageDescription: DO-214-AA/SMB; 2 C-Bend Leads; Body 5.3 x 3.6 mm, inc. leads (LxW); Code_JEDEC: DO-214-AA
L2 = ETQ-P5M1R5YFC: No Description Available; Manufacturer_Name: Panasonic; Copyright: Copyright (C) 2025 Ultra Librarian. All rights reserved.; Manufacturer_Part_Number: ETQ-P5M1R5YFC
Q8 = CMP-14406-000010-1: TRANS NPN 65V 0.1A SOT23; Manufacturer: Nexperia; Collector Emitter Saturation Voltage: 200mV; Hfe Max: 450; Number Of Npn: 1; Max Junction Temp: +150°C; Hfe Min: 110; Power Dissipation: 250mW; Collector Base Voltage: 80V; Unity Gain Freq: 100MHz; Hfe Testvce: 5V; Emitter Base Voltage: 6V; Max Collector Current: 100mA; Rthja Max: 500K/W; Hfe Testic: 2mA; Automotive Grade: Grade 0; Temperature: to +150°C; Category: Trans; Octopart: https://octopart.com/bc846a%2C215-nexperia-78739089; Device Class L2: Transistors; ComponentLink2Description: Datasheet; Collector Emitter Voltage: 65V; Device Class L1: Discrete Semiconductors; Digikey Description: TRANS NPN 65V 0.1A SOT23; Package: SOT23; Manufacturer Part Number: BC846A,215; Footprint Url: https://assets.nexperia.com/documents/outline-drawing/SOT23.pdf; RoHS: TRUE; Device Class L3: BJTs; Ambient Temperature Range Low: -65°C; ComponentLink2URL: https://assets.nexperia.com/documents/data-sheet/BC846_SER.pdf; Temperature Range High: +150°C; Lead Free: Yes; Height: 1.1mm; Mouser Description: BC846 Series 65 V 100 mA NPN SMT General Purpose Transistor - SOT-23; Automotive: Yes; Number Of Elements: 1; Ambient Temperature Range High: +150°C
Q9 = T93YA503KT20: T93 YA 50K 10% TU50 e3; Manufacturer_Name: Vishay; Type: Trimmer Potentiometers; Copyright: Copyright (C) 2025 Ultra Librarian. All rights reserved.; Manufacturer_Part_Number: T93YA503KT20; Datasheet: https://www.vishay.com/doc?51026
Q10-Q13 = CMP-32901-001056-1: MOSFET N-CH 55V 75A TO220AB; Element Configuration: Single; Drain to Source Resistance: 4.7mR; Power Dissipation: 330W; Threshold Voltage: 4V; Turn-On Delay Time: 14ns; Gate to Source Voltage (Vgs): 20V; Polarization: N; Turn-Off Delay Time: 68ns; Input Capacitance: 5.11nF; Max Dual Supply Voltage: 55V; Number of Pins: 3; RoHS Compliant: Yes; REACH SVHC: No SVHC; Case/Package: TO-220; Rds On Max: 4.7mR; Width: 0.19inch; Min Operating Temperature: -55°C; Drain to Source Breakdown Voltage: 55V; Packaging: Rail/Tube; Lead Free: Lead Free; Length: 0.42inch; Max Operating Temperature: 175°C; Series: HEXFET®; Drain to Source Voltage (Vdss): 55V; Max Power Dissipation: 330W; Continuous Drain Current (ID): 75A; Height: 0.65inch; Halogen Free: Halogen Free; Mount: Through Hole
R74-R92 = Res3: Resistor; Published: 8-Jun-2000; LatestRevisionDate: 29-May-2009; LatestRevisionNote: IPC-7351 Footprint Added.; PackageReference: J1-0603; Publisher: Altium Limited; PackageDescription: Chip Resistor
U7 = CMP-04918-000350-1: Switching Frequency: 600kHz; Max Duty Cycle: 100%; Number of Output Phases: 1; Output Configuration: Positive; Clock Sync: Yes; Topology: Buck-Boost; Packaging: Tape and Reel; Number of Outputs: 1; Number of Pins: 28; Min Operating Temperature: -40°C; Max Operating Temperature: 125°C; Synchronous Rectifier: Yes; RoHS Compliant: Yes
U8 = CMP-04895-000442-1: IC OPAMP GP 2 CIRCUIT 8SOIC; Output Current per Channel: 40mA; Input Offset Voltage (Vos): 1mV; Operating Supply Current: 90uA; Number of Circuits: 2; Input Bias Current: 15pA; Slew Rate: 1.5V/µs; Gain Bandwidth Product: 1MHz; Number of Pins: 8; Mount: Surface Mount; Packaging: Cut Tape; RoHS Compliant: Yes; Case/Package: SOIC; Min Operating Temperature: -40°C; Max Operating Temperature: 125°C

## Sheet Output.SchDoc
size A3; SheetNumber: 6; SheetTotal: 6; SPICEModelCacheDUFQVYXA: <root> / <DocumentId>DUFQVYXA</DocumentId> / <CacheFrame Number="0"> / <Model Name="cap" Kind="MDL"> / <Text>*Default semiconductor capacitor / .MODEL CAP C()</Text> / </Model> / </CacheFrame> / </root>
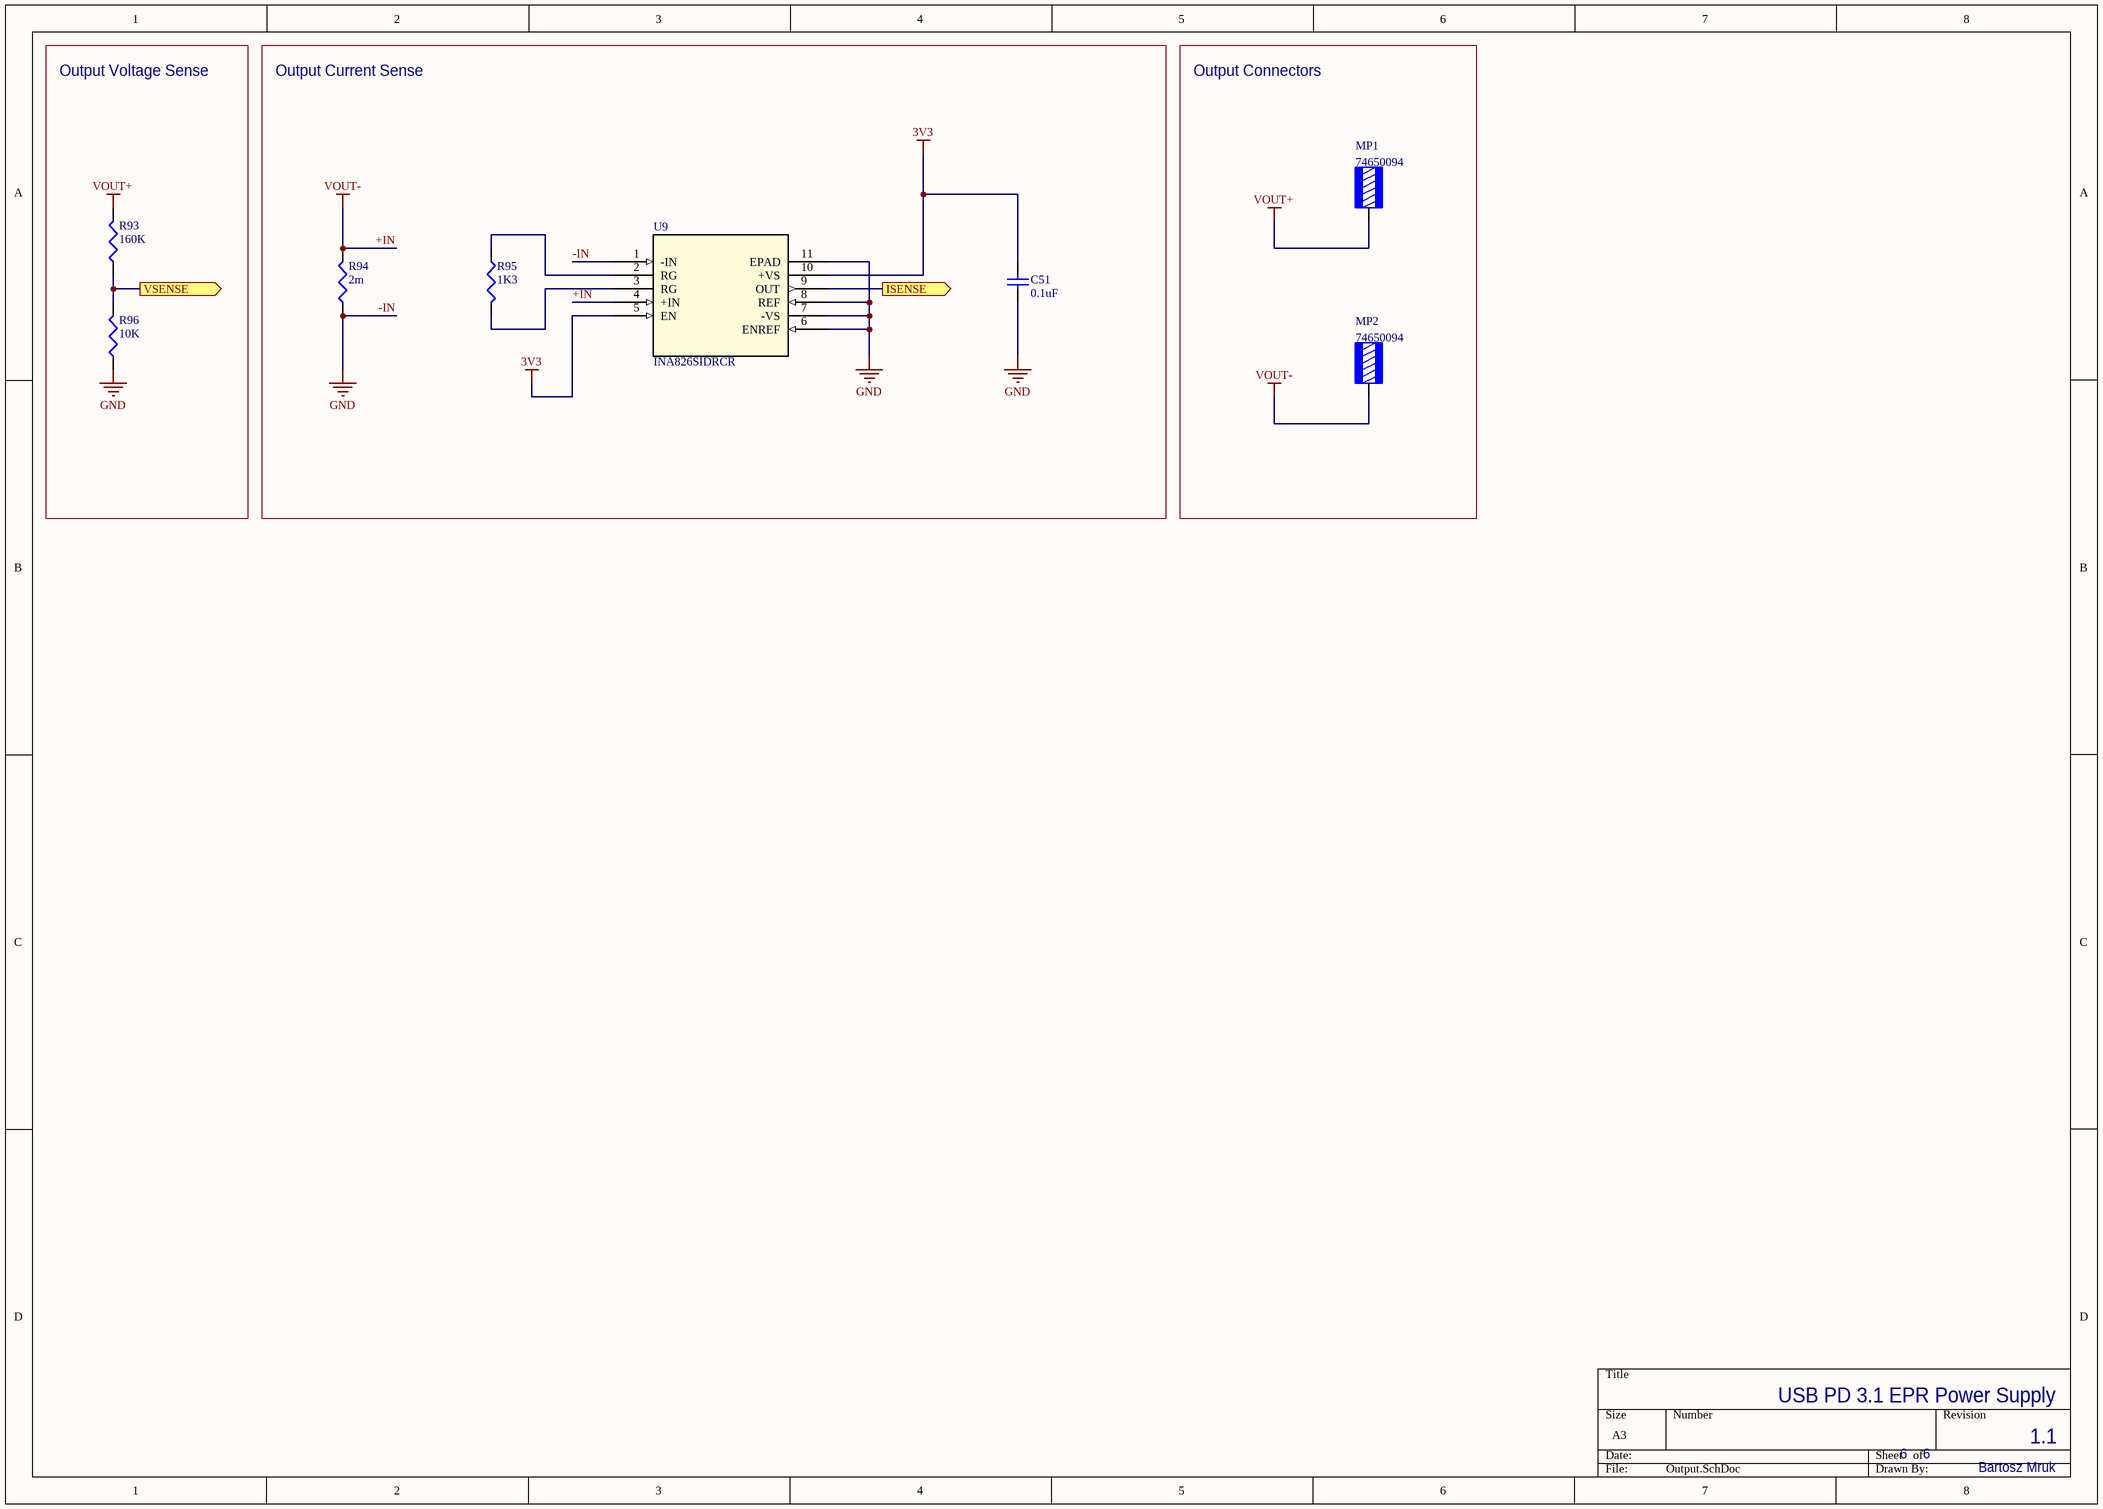
[diagram p5: Output.SchDoc]

### Parts
C51  value 0.1uF  [1608[0603]]
MP1  74650094  [74650094]
MP2  74650094  [74650094]
R93  value 160K  [J1-0603]  (hidden comment: Res3)
R94  value 2m  [RESC6332]  (hidden comment: Res3)
R95  value 1K3  [J1-0603]  (hidden comment: Res3)
R96  value 10K  [J1-0603]  (hidden comment: Res3)
U9  INA826SIDRCR  [DRC10_TEX]

### Blocks framed on the sheet
Output Voltage Sense: R93 R96
Output Current Sense: C51 R94 R95 U9
Output Connectors: MP1 MP2

### Ports
ISENSE (out), VSENSE (out)

### Nets
3V3: C51.2 U9.5(EN) U9.10(+VS)
GND: C51.1 R94.1 R96.1 U9.1(-IN) U9.6(ENREF) U9.7(-VS) U9.8(REF) U9.11(EPAD)  [also labelled -IN]
VOUT+: MP1.1 R93.2
VOUT-: MP2.1 R94.2 U9.4(+IN)  [also labelled +IN]
NetR4_1: R93.1 R96.2 ; port VSENSE
NetR6_1: U9.9(OUT) ; port ISENSE
NetR95_1: R95.1 U9.2(RG)
NetR95_2: R95.2 U9.3(RG)

### Notes on the sheet
- 6
- 1.1
- USB PD 3.1 EPR Power Supply
- Bartosz Mruk

### Library data of the parts
C51 = Cap Semi: Capacitor (Semiconductor SIM Model); Published: 8-Jun-2000; LatestRevisionDate: 29-May-2009; LatestRevisionNote: IPC-7351 Footprint Added.; PackageReference: C1206; Publisher: Altium Limited; PackageDescription: Chip Capacitor
MP1 MP2 = CMP-03913-89699612-2: WP-THRBU REDCUBE Bush, THR_open; Current Rating: 85A; Packaging: Bulk; Min Operating Temperature: -55°C; Number of Pins: 8; Height: 3mm; RoHS: Compliant; Width: 10mm; Max Operating Temperature: 150°C; Material: Brass
R93-R96 = Res3: Resistor; Published: 8-Jun-2000; LatestRevisionDate: 29-May-2009; LatestRevisionNote: IPC-7351 Footprint Added.; PackageReference: J1-0603; Publisher: Altium Limited; PackageDescription: Chip Resistor
U9 = INA826SIDRCR: 200 Î¼A, 36V, Rail-to-Rail Out Instrumentation Amplifier with Shutdown 10-VSON -40 to 125; Manufacturer_Name: Texas Instruments; Copyright: Copyright (C) 2025 Ultra Librarian. All rights reserved.; Manufacturer_Part_Number: INA826SIDRCR; Datasheet: https://www.ti.com/lit/gpn/ina826s; RefDes: RefDes; Type: Type

## Nets that join several sheets
3V3: USB-C (C18.2 C19.2 U4.32), Microcontroller (11 pins), LogicPower (11 pins), Main_DC-DC_Converter (C31.2 U8.8), Output (C51.2 U9.5 U9.10)
5V: USB-C (5 pins), LogicPower (8 pins)
GND: USB-C (37 pins), Microcontroller (13 pins), LogicPower (19 pins), Main_DC-DC_Converter (31 pins), Output (8 pins)
PPEXT: USB-C (Q3.5 Q3.6 Q3.7 Q3.8), Main_DC-DC_Converter (C32.2 D3.1 Q11.2)
VBUS: USB-C (16 pins), LogicPower (C22.2 U5.2 U5.7)
VOUT+: Main_DC-DC_Converter (C48.2 C49.2 D2.1 L2.1), Output (MP1.1 R93.2)
NetR1_2: Microcontroller (R1.2), Main_DC-DC_Converter (U7.1)
NetR3_2: Microcontroller (R3.2), Main_DC-DC_Converter (U7.17)
NetR4_1: Microcontroller (R4.1), Output (R93.1 R96.2)
NetR6_1: Microcontroller (R6.1), Output (U9.9)
NetR10_2: Microcontroller (R10.2), Main_DC-DC_Converter (U8.2)
NetR24_2: USB-C (R57.1 U4.10), Microcontroller (R24.2)
NetR25_2: USB-C (R55.1 U4.8), Microcontroller (R25.2)
NetR27_2: USB-C (R56.1 U4.9), Microcontroller (R27.2)